# Altium project #NIP涡轮驱动板V1.00.PrjPcb
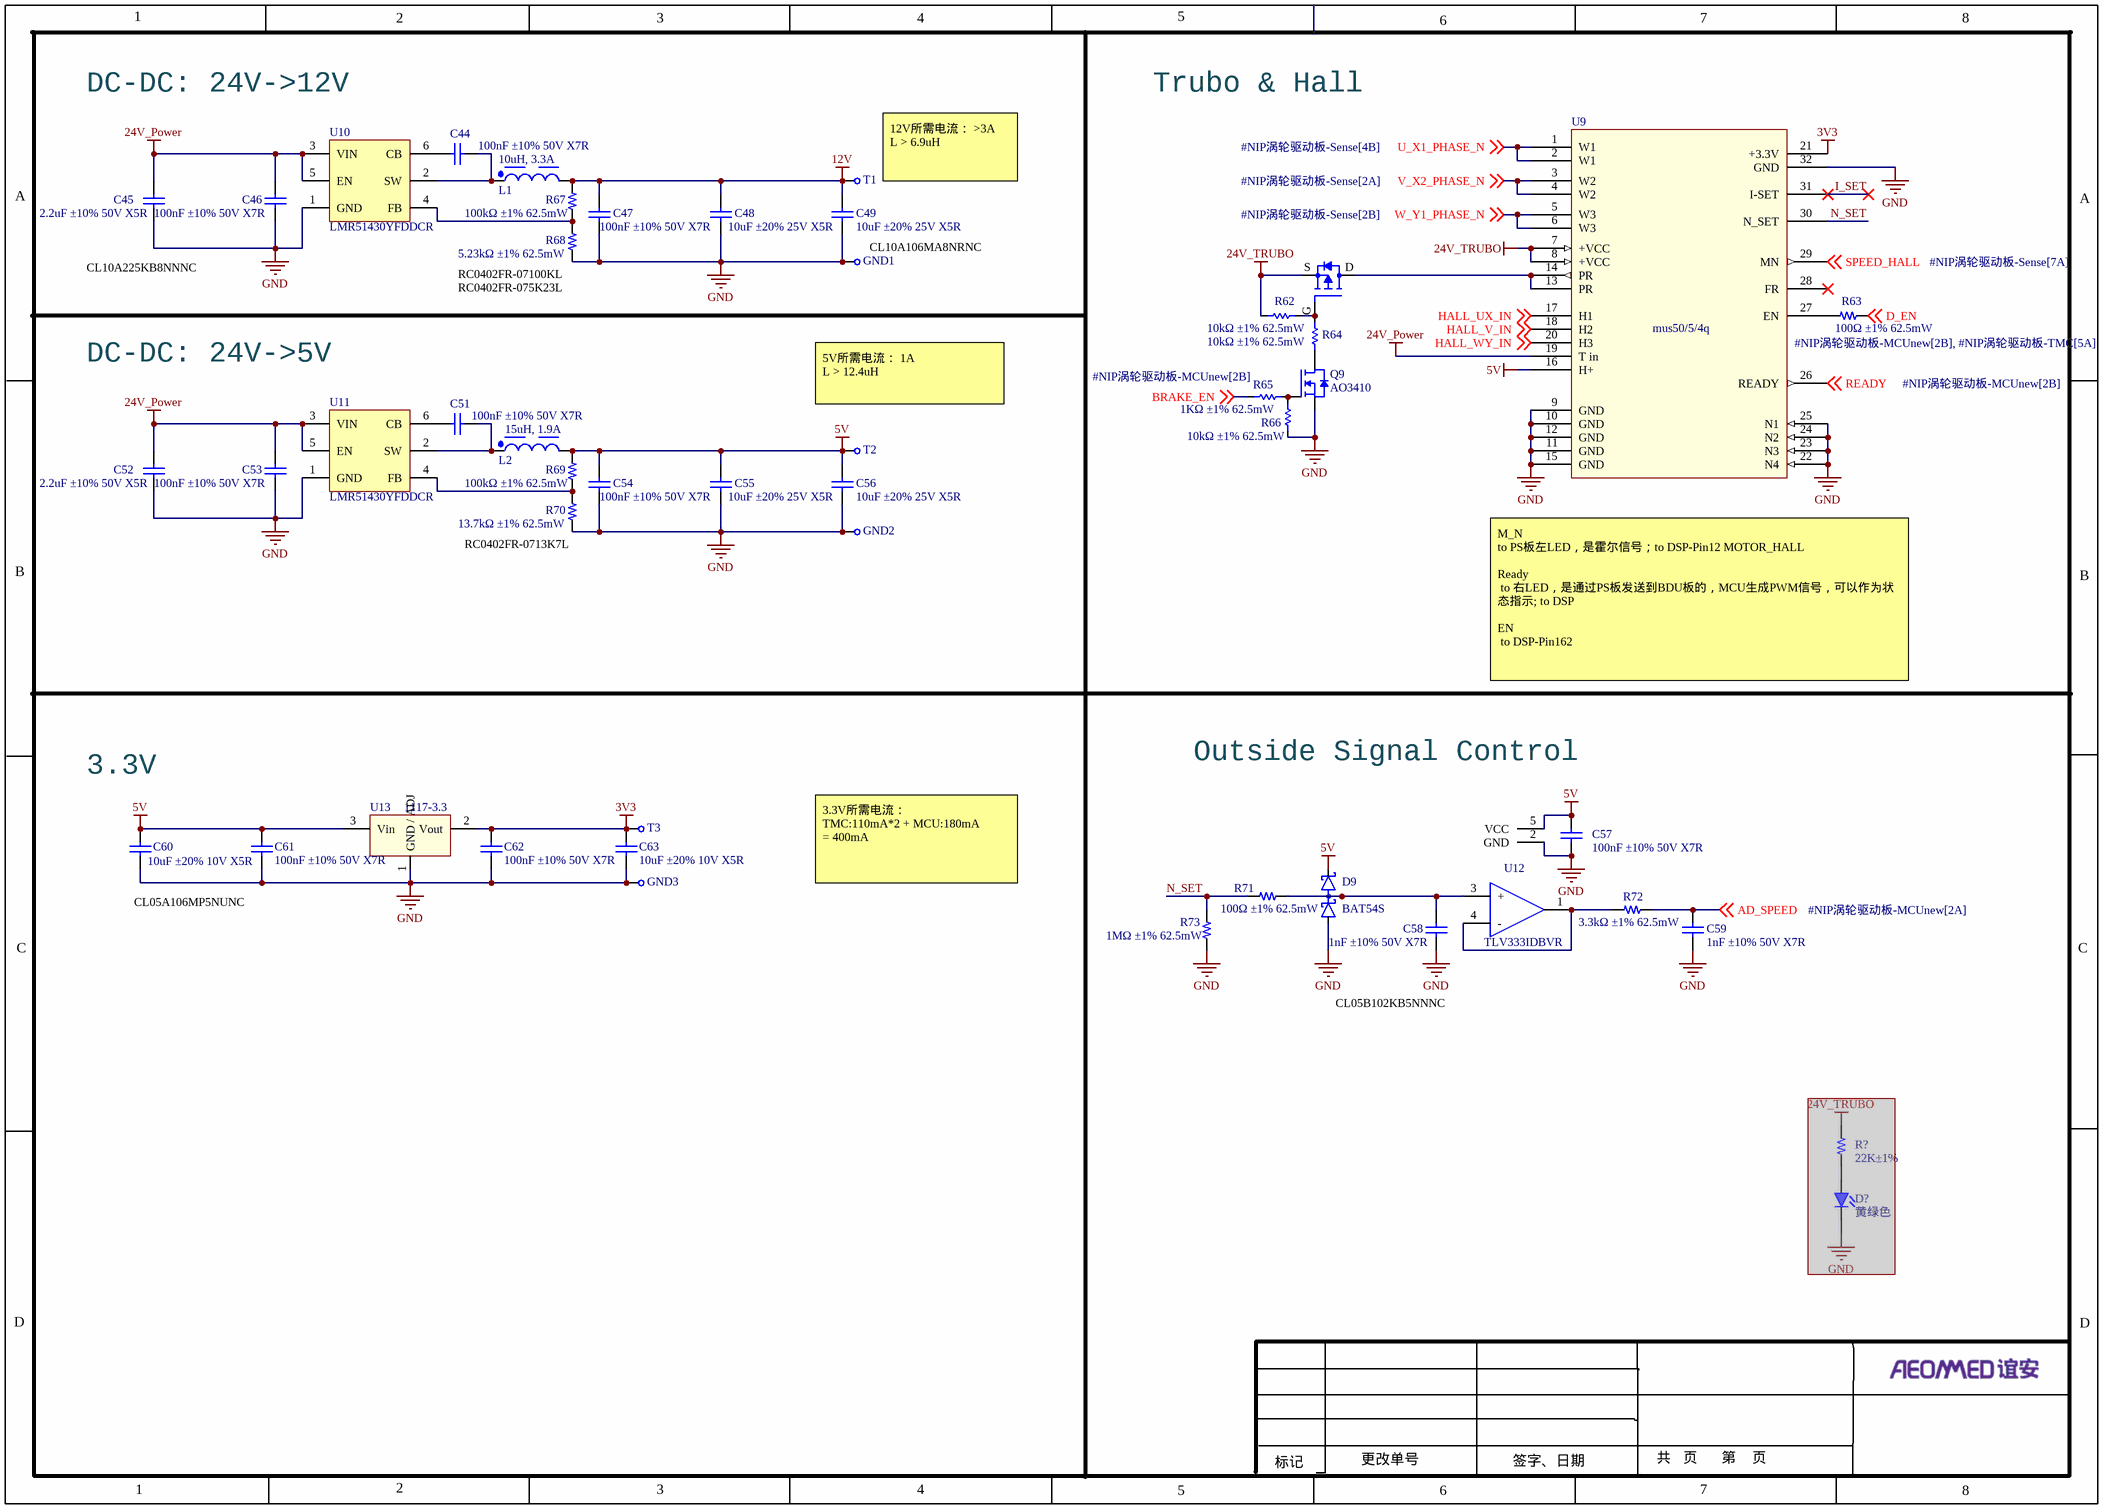
[diagram p0: #NIP涡轮驱动板-Power.SchDoc]
5 sheets, 200 parts. Net scope: global (net labels, ports and power ports of the same name join across sheets).
Board file: Turbo.PcbDoc
Sheets:
  #NIP涡轮驱动板-Power.SchDoc
  #NIP涡轮驱动板-TMC.SchDoc
  #NIP涡轮驱动板-MCUnew.SchDoc
  #NIP涡轮驱动板-DRIVE.SchDoc
  #NIP涡轮驱动板-Sense.SchDoc

## Sheet #NIP涡轮驱动板-Power.SchDoc
size A3; SPICEModelCacheKVCDXOIC: <root> / <DocumentId>KVCDXOIC</DocumentId> / <CacheFrame Number="0"> / <Model Name="4020_74438356150_15u" Kind="CKT"> / <Text>******* / .subckt 4020_74438356150_15u 1 2 / Rp 1 2 14200 / Cp 1 2 9.62p / Rs 1 N3 0.2 / L1 N3 2 14.1u / .ends 4020_74438356150_15u</Text> / </Model> / <Model Name="5030_74438367100_10u" Kind="CKT"> / <Text>******* / .subckt 5030_74438367100_10u 1 2 / Rp 1 2 7290 / Cp 1 2 15.66p / Rs 1 N3 0.061 / L1 N3 2 9.563u / .ends 5030_74438367100_10u</Text> / </Model> / </CacheFrame> / </root>

### Parts
(Parts that share a designator on the sheet are numbered #1, #2 ... from top to bottom, then left to right.)
C44  100nF ±10% 50V X7R  [C0402]
C45  2.2uF ±10% 50V X5R  [C0603]
C46  100nF ±10% 50V X7R  [C0402]
C47  100nF ±10% 50V X7R  [C0402]
C48  10uF ±20% 25V X5R  [C0603]
C49  10uF ±20% 25V X5R  [C0603]
C51  100nF ±10% 50V X7R  [C0402]
C52  2.2uF ±10% 50V X5R  [C0603]
C53  100nF ±10% 50V X7R  [C0402]
C54  100nF ±10% 50V X7R  [C0402]
C55  10uF ±20% 25V X5R  [C0603]
C56  10uF ±20% 25V X5R  [C0603]
C57  100nF ±10% 50V X7R  [C0402]
C58  1nF ±10% 50V X7R  [C0402]
C59  1nF ±10% 50V X7R  [C0402]
C60  10uF ±20% 10V X5R  [C0402]
C61  100nF ±10% 50V X7R  [C0402]
C62  100nF ±10% 50V X7R  [C0402]
C63  10uF ±20% 10V X5R  [C0402]
D9  BAT54S  [SOT23-3]
D?  黄绿色  [LED-0805]  (masked out: inside a compile mask, not in the netlist)
GND1  test_point  [TP-SIP-1-GND]  (value not drawn)
GND2  test_point  [TP-SIP-1-GND]  (value not drawn)
GND3  test_point  [TP-SIP-1-GND]  (value not drawn)
L1  10uH, 3.3A  [WE-MAPI_5030]
L2  15uH, 1.9A  [WE-MAPI_4020]
Q8  SI7463ADP-T1-GE3  [POWERPAK-SO-8_L6.1-W5.1-P1.27-BL-EP]  (value not drawn)
Q9  AO3410  [SOT23-3]
R62  10kΩ ±1% 62.5mW  [R0402]
R63  100Ω ±1% 62.5mW  [R0402]
R64  10kΩ ±1% 62.5mW  [R0402]
R65  1KΩ ±1% 62.5mW  [R0402]
R66  10kΩ ±1% 62.5mW  [R0402]
R67  100kΩ ±1% 62.5mW  [R0402]
R68  5.23kΩ ±1% 62.5mW  [R0402]
R69  100kΩ ±1% 62.5mW  [R0402]
R70  13.7kΩ ±1% 62.5mW  [R0402]
R71  100Ω ±1% 62.5mW  [R0402]
R72  3.3kΩ ±1% 62.5mW  [R0402]
R73#1  1MΩ ±1% 62.5mW  [R0402]
R?  22K±1%  [R-0603]  (masked out: inside a compile mask, not in the netlist)
T1  test_point  [TP-SIP-1-Small]  (value not drawn)
T2  test_point  [TP-SIP-1-Small]  (value not drawn)
T3  test_point  [TP-SIP-1-Small]  (value not drawn)
U9  mus50/5/4q  [MUS50/5/4Q]
U10  LMR51430YFDDCR  [SOT-23-6_L2.9-W1.6-P0.95-LS2.9-BL]
U11  LMR51430YFDDCR  [SOT-23-6_L2.9-W1.6-P0.95-LS2.9-BL]
U12  TLV333IDBVR  [SOT23-5]
U13  1117-3.3  [SOT-89-3_L4.5-W2.5-P1.50-LS4.0-BR]

### Nets
3V3: C62.2 C63.2 T3.1 U9.21(+3.3V) U13.2(Vout)
5V: C54.2 C55.2 C56.2 C57.2 C60.2 C61.2 D9.2(C2) L2.2 R69.2 T2.1 U9.16(H+) U12.5(VCC) U13.3(Vin)
12V: C47.2 C48.2 C49.2 L1.2 R67.2 T1.1
24V_Power: C45.2 C46.2 C52.2 C53.2 U9.19(T_in) U10.3(VIN) U10.5(EN) U11.3(VIN) U11.5(EN)
24V_TRUBO: Q8.S R62.2 U9.7(+VCC) U9.8(+VCC)
GND: C45.1 C46.1 C47.1 C48.1 C49.1 C52.1 C53.1 C54.1 C55.1 C56.1 C57.1 C58.1 C59.1 C60.1 C61.1 C62.1 C63.1 D9.1(A1) GND1.1 GND2.1 GND3.1 Q9.2(S) R66.2 R68.2 R70.2 R73#1.1 U9.9(GND) U9.10(GND) U9.11(GND) U9.12(GND) U9.15(GND) U9.22(N4) U9.23(N3) U9.24(N2) U9.25(N1) U9.32(GND) U10.1(GND) U11.1(GND) U12.2(GND) U13.1(GND_/_ADJ)
AD_SPEED: C59.2 R72.1 ; off-sheet AD_SPEED
BRAKE_EN: R65.1 ; off-sheet BRAKE_EN
D_EN: R63.1 ; off-sheet D_EN
HALL_UX_IN: U9.17(H1) ; off-sheet HALL_UX_IN
HALL_V_IN: U9.18(H2) ; off-sheet HALL_V_IN
HALL_WY_IN: U9.20(H3) ; off-sheet HALL_WY_IN
I_SET: U9.31(I-SET)
N_SET: R71.1 R73#1.2 U9.30(N_SET)
READY: U9.26(READY) ; off-sheet READY
SPEED_HALL: U9.29(MN) ; off-sheet SPEED_HALL
U_X1_PHASE_N: U9.1(W1) U9.2(W1) ; off-sheet U_X1_PHASE_N
V_X2_PHASE_N: U9.3(W2) U9.4(W2) ; off-sheet V_X2_PHASE_N
W_Y1_PHASE_N: U9.5(W3) U9.6(W3) ; off-sheet W_Y1_PHASE_N
NetC44_1: C44.1 L1.1 U10.2(SW)
NetC44_2: C44.2 U10.6(CB)
NetC51_1: C51.1 L2.1 U11.2(SW)
NetC51_2: C51.2 U11.6(CB)
NetC58_2: C58.2 D9.3(C1A2) R71.2 U12.3(+)
NetQ8_D: Q8.D U9.13(PR) U9.14(PR)
NetQ8_G: Q8.G R62.1 R64.1
NetQ9_1: Q9.1(G) R65.2 R66.1
NetQ9_3: Q9.3(D) R64.2
NetR63_2: R63.2 U9.27(EN)
NetR67_1: R67.1 R68.1 U10.4(FB)
NetR69_1: R69.1 R70.1 U11.4(FB)
NetR72_2: R72.2 U12.1 U12.4(-)

Not connected (* = marked no-connect by the designer): U9 28(FR)*

### Notes on the sheet
- DC-DC: 24V->12V
- Trubo & Hall
- (near T1) 12V所需电流： >3A
  L > 6.9uH
- (near C45) CL10A225KB8NNNC
- (near R68) RC0402FR-07100KL
- (near R68) RC0402FR-075K23L
- (near GND1) CL10A106MA8NRNC
- DC-DC: 24V->5V
- 5V所需电流： 1A
  L > 12.4uH
- (near R70) RC0402FR-0713K7L
- M_N
  to PS板左LED，是霍尔信号；to DSP-Pin12 MOTOR_HALL
  Ready
  to 右LED，是通过PS板发送到BDU板的，MCU生成PWM信号，可以作为状态指示; to DSP
  EN
  to DSP-Pin162
- 3.3V
- Outside Signal Control
- CL05A106MP5NUNC
- 3.3V所需电流：
  TMC:110mA*2 + MCU:180mA
  = 400mA
- CL05B102KB5NNNC
- 1
- 2
- 3
- 4
- 5
- 6
- 7
- 8
- A
- B
- C
- D
- 更改单号
- 共   页      第    页
- 标记
- 签字、日期

### Library data of the parts
C44 C46 C47 C51 C53 C54 C57 C61 C62 = Cap: Capacitor; Published: 8-Jun-2000; LatestRevisionDate: 17-Jul-2002; LatestRevisionNote: Re-released for DXP Platform.; PackageReference: RAD-0.3; Publisher: Altium Limited; PackageDescription: Radial Cap, Thru-Hole; 2 Leads; 0.3 in Pin Spacing
C45 C52 = Cap: CL10A225KB8NNNC; Published: 8-Jun-2000; LatestRevisionDate: 17-Jul-2002; LatestRevisionNote: Re-released for DXP Platform.; PackageReference: RAD-0.3; Publisher: Altium Limited; PackageDescription: Radial Cap, Thru-Hole; 2 Leads; 0.3 in Pin Spacing
C48 C49 C55 C56 = Cap: CL10A106MA8NRNC; Published: 8-Jun-2000; LatestRevisionDate: 17-Jul-2002; LatestRevisionNote: Re-released for DXP Platform.; PackageReference: RAD-0.3; Publisher: Altium Limited; PackageDescription: Radial Cap, Thru-Hole; 2 Leads; 0.3 in Pin Spacing
C58 C59 = Cap: CL05B102KB5NNNC; Published: 8-Jun-2000; LatestRevisionDate: 17-Jul-2002; LatestRevisionNote: Re-released for DXP Platform.; PackageReference: RAD-0.3; Publisher: Altium Limited; PackageDescription: Radial Cap, Thru-Hole; 2 Leads; 0.3 in Pin Spacing
C60 C63 = Cap: CL05A106MP5NUNC; Published: 8-Jun-2000; LatestRevisionDate: 17-Jul-2002; LatestRevisionNote: Re-released for DXP Platform.; PackageReference: RAD-0.3; Publisher: Altium Limited; PackageDescription: Radial Cap, Thru-Hole; 2 Leads; 0.3 in Pin Spacing
D9 = BAT54S: 品牌：NXP，型号：BAT54S，0.11A,30V，ROHS; MF: NXP; MPN: BAT54S
D? = LED-0805: 品牌:Everlight（亿光），型号17-21SYGC/S530-E2/TR8，Typ.23mcd@20mA，ROHS
GND1-GND3 T1-T3 = TP-SIP-1-Small
L1 = 74438367100: WE-MAPI, size 5030, 10uH, 3.3A, 70.2mOhm; Manufacturer: Wurth Elektronik; Case/Size Code: 5030; DC Resistance: 61mOhm; Saturation Current: 4.8A; Self Resonant Frequency: 13MHz; Manufacturer Part Number: 74438367100; Match Code: WE-MAPI; ComponentLink1Description: Website Link; ComponentLink1URL: https://www.we-online.com/redexpert/article/74438367100?ad; ComponentLink2Description: Datasheet Link; ComponentLink2URL: https://www.we-online.com/redexpert/spec/74438367100?ad; Mount: Surface Mount; Operating Temperature Max: 125°C; Operating Temperature Min: -40°C; Packaging: Tape and Reel; Length: 5.4mm; Width: 5.4mm; Height: 3.1mm; DC Resistance Max: 70.2mOhm; Inductance: 10uH; Rated Current: 3.3A
L2 = 74438356150: WE-MAPI, size 4020, 15uH, 1.9A, 230mOhm; Manufacturer: Wurth Elektronik; Case/Size Code: 4020; DC Resistance: 200mOhm; Saturation Current: 2.1A; Self Resonant Frequency: 14MHz; Manufacturer Part Number: 74438356150; Match Code: WE-MAPI; ComponentLink1Description: Website Link; ComponentLink1URL: https://www.we-online.com/redexpert/article/74438356150?ad; ComponentLink2Description: Datasheet Link; ComponentLink2URL: https://www.we-online.com/redexpert/spec/74438356150?ad; Mount: Surface Mount; Operating Temperature Max: 125°C; Operating Temperature Min: -40°C; Packaging: Tape and Reel; Length: 4.1mm; Width: 4.1mm; Height: 2.1mm; DC Resistance Max: 230mOhm; Inductance: 15uH; Rated Current: 1.9A
Q8 = MOSFET-P: 类型 P沟道 / 漏源电压(Vdss) 40V / 连续漏极电流(Id) 46A / 功率(Pd) 5W；39W / 导通电阻(RDS(on)@Vgs,Id) 10mΩ@15A,10V / 阈值电压(Vgs(th)@Id) 2.3V@250uA; Manufacturer: VISHAY(威世); Add into BOM: yes; Total Gate Charge (Qg@Vgs): 144nC@10V; Input Capacitance (Ciss@Vds): 4.15nF@20V; Symbol: SI7463ADP-T1-GE3; Device: SI7463ADP-T1-GE3; Supplier: LCSC; Supplier Part: C469466; Manufacturer Part: SI7463ADP-T1-GE3; JLCPCB Part Class: Extended Part; LCSC Part Name: P沟道 耐压:40V 电流:46A; Supplier Footprint: PowerPAK-SO-8; Datasheet: https://atta.szlcsc.com/upload/public/pdf/source/20201103/C469466_DEB614A703506C939C03FF0A9B0AE822.pdf; Convert to PCB: yes; Type: P沟道; Drain Source Voltage (Vdss): 40V; Continuous Drain Current (Id): 46A; Power Dissipation (Pd): 5W；39W; Drain Source On Resistance (RDS(on)@Vgs,Id): 10mΩ@15A,10V; Gate Threshold Voltage (Vgs(th)@Id): 2.3V@250uA; Reverse Transfer Capacitance (Crss@Vds): -; Operating Temperature: -55℃~+150℃@(Tj)
R62 R64-R66 = Res_0402: Resistor; Published: 8-Jun-2000; LatestRevisionDate: 17-Jul-2002; LatestRevisionNote: Re-released for DXP Platform.; PackageReference: AXIAL-0.3; Publisher: Altium Limited; PackageDescription: Axial Device, Thru-Hole; 2 Leads; 0.3 in Pin Spacing
R63 R71 R72 R73#1 R? = R-0603
R67 R69 = R-0603: RC0402FR-07100KL
R68 = R-0603: RC0402FR-075K23L
R70 = R-0603: RC0402FR-0713K7L
U9 = mus50/5/4q: 品牌：长江（CJT） / A: A2005WVA-12P / B: A2541WV-2x10P
U10 U11 = LMR51430Y: 输入电压 4.5V~36V / 输出电压 600mV~34.2V / 输出电流(最大值) 3A / 开关频率 1.1MHz / 工作温度 -40℃~+150℃ / 静态电流(Iq) 40uA
U12 = TLV333IDBVR: 品牌：TI，型号：TLV333IDBVR,SOIC-8,–25°~+85°C,单运放，ROHS
U13 = 1117_SOT89: SOT-89-3

## Sheet #NIP涡轮驱动板-TMC.SchDoc
size A3
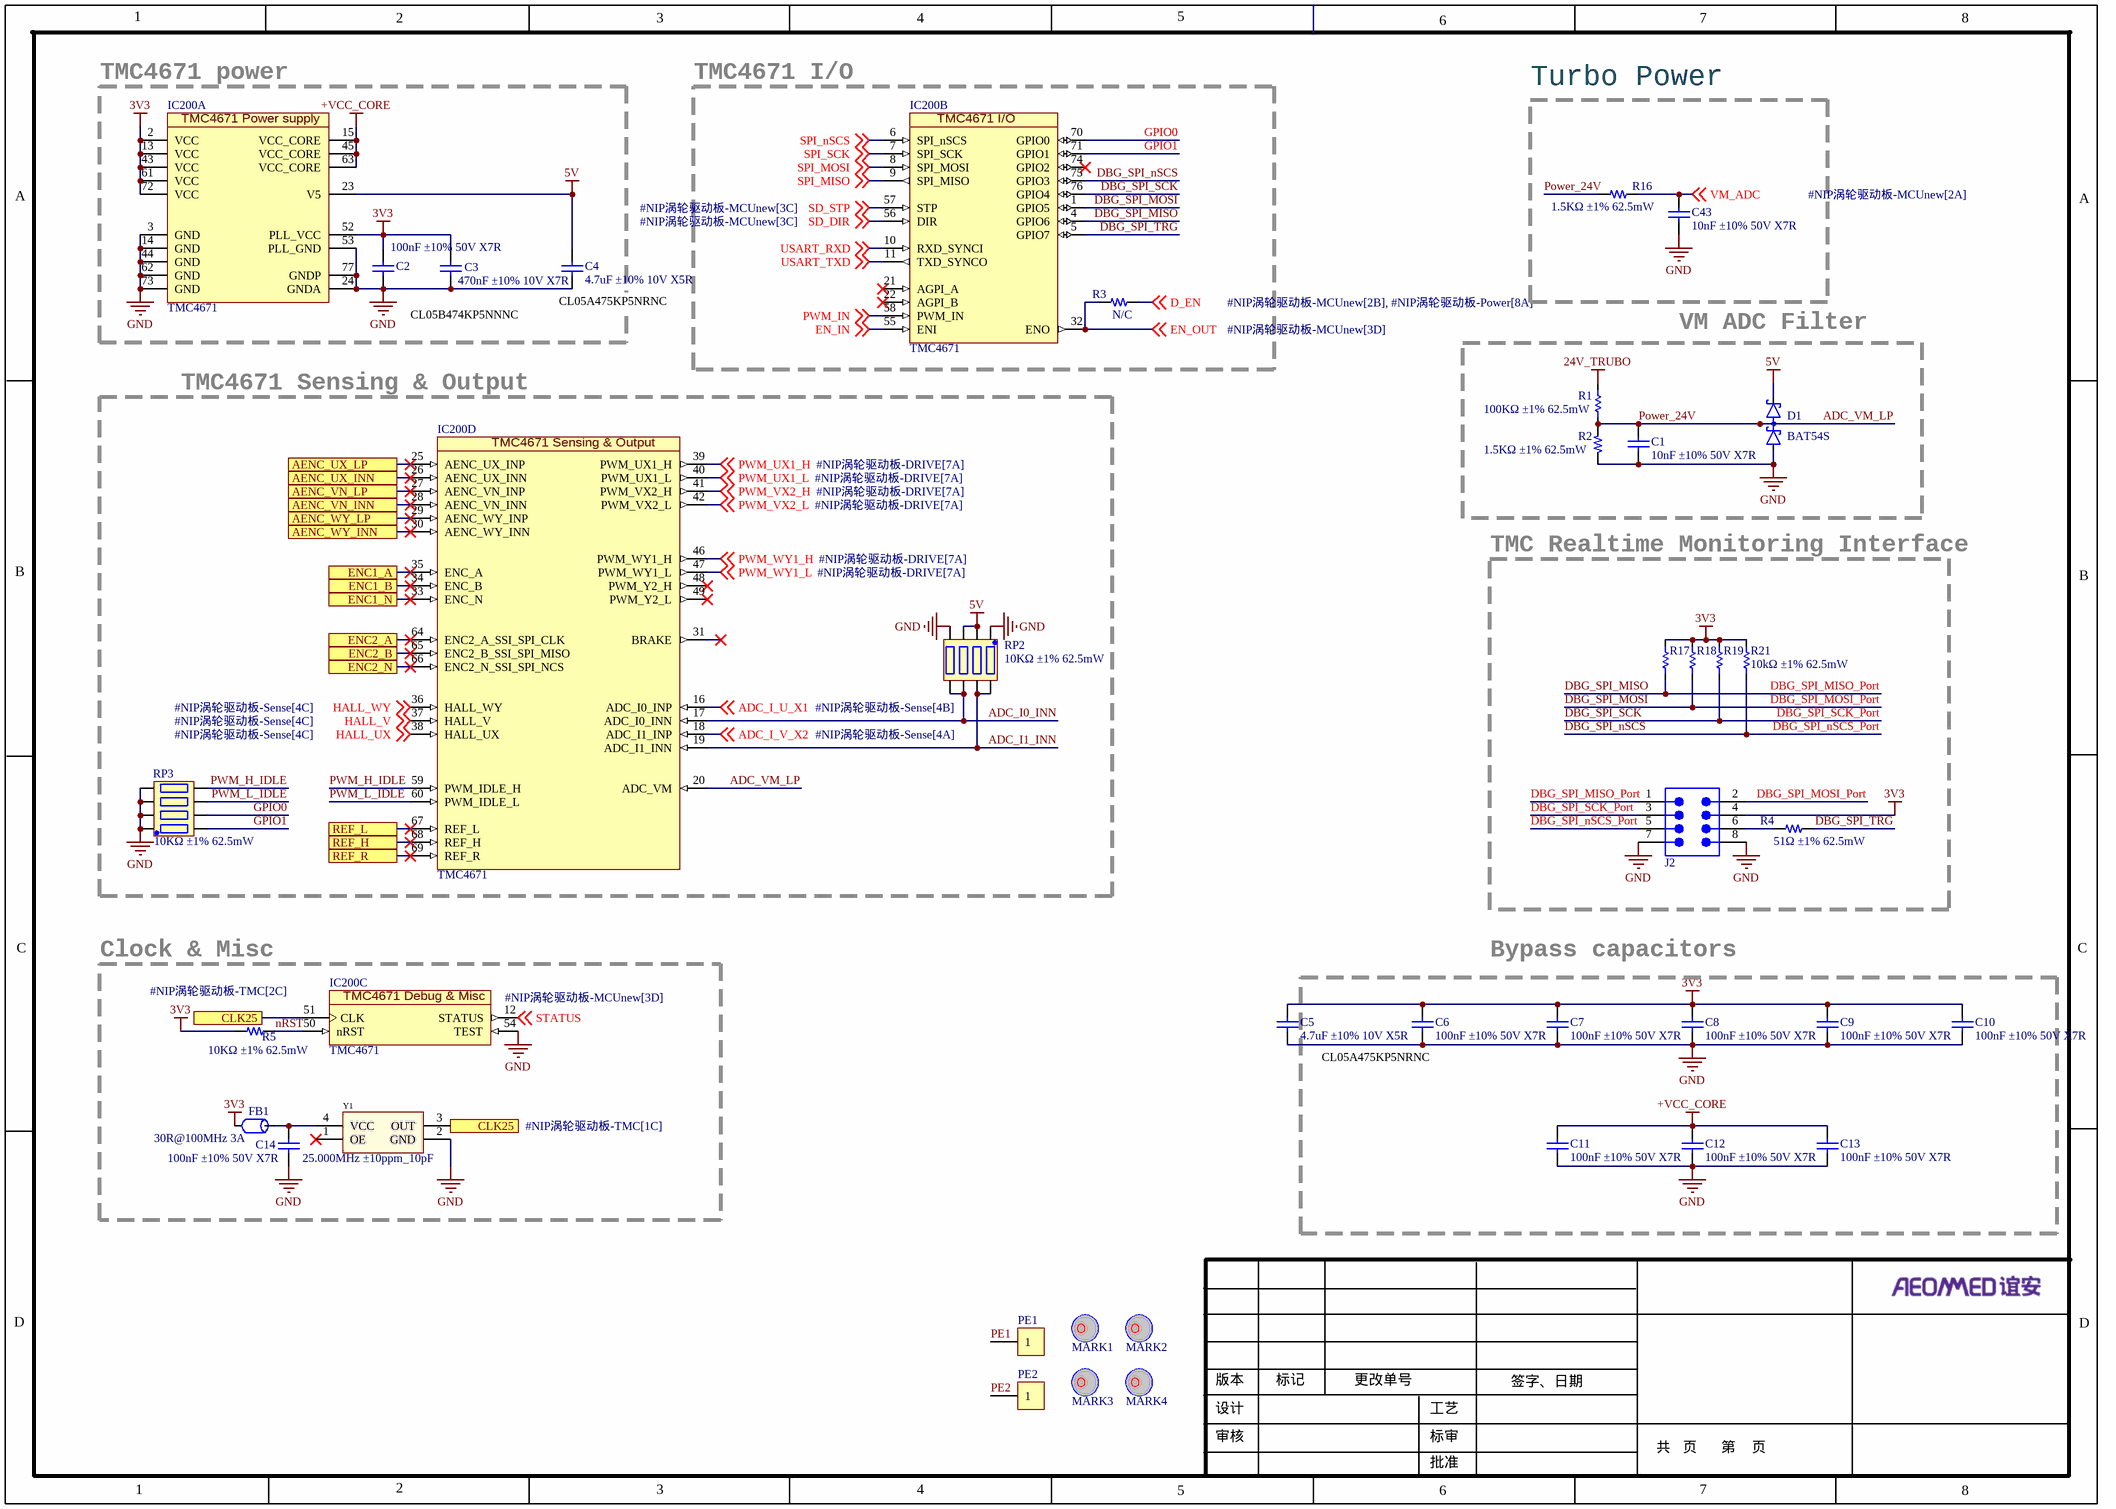
[diagram p1: #NIP涡轮驱动板-TMC.SchDoc]

### Parts
C1  10nF ±10% 50V X7R  [C0402]
C2  100nF ±10% 50V X7R  [C0402]
C3  470nF ±10% 10V X7R  [C0402]
C4  4.7uF ±10% 10V X5R  [C0402]
C5  4.7uF ±10% 10V X5R  [C0402]
C6  100nF ±10% 50V X7R  [C0402]
C7  100nF ±10% 50V X7R  [C0402]
C8  100nF ±10% 50V X7R  [C0402]
C9  100nF ±10% 50V X7R  [C0402]
C10  100nF ±10% 50V X7R  [C0402]
C11  100nF ±10% 50V X7R  [C0402]
C12  100nF ±10% 50V X7R  [C0402]
C13  100nF ±10% 50V X7R  [C0402]
C14  100nF ±10% 50V X7R  [C0402]
C43  10nF ±10% 50V X7R  [C0402]
D1  BAT54S  [SOT23-3]
FB1  30R@100MHz 3A  [FB-0603]
IC200  TMC4671  [QFN40P1050X650X90_HS-77N]  (parts A,B,C,D of 5)
J2  62000821121  [62000821121]  (value not drawn)
MARK1  MARK_POINT  [MARK_POINT]  (value not drawn)
MARK2  MARK_POINT  [MARK_POINT]  (value not drawn)
MARK3  MARK_POINT  [MARK_POINT]  (value not drawn)
MARK4  MARK_POINT  [MARK_POINT]  (value not drawn)
PE1  (no value)  [固定孔-M3]
PE2  (no value)  [固定孔-M3]
R1  100KΩ ±1% 62.5mW  [R0402]
R2  1.5KΩ ±1% 62.5mW  [R0402]
R3  N/C  [R0402]
R4  51Ω ±1% 62.5mW  [R0402]
R5  10KΩ ±1% 62.5mW  [R0402]
R16  1.5KΩ ±1% 62.5mW  [R0402]
R17  10kΩ ±1% 62.5mW  [R0402]  (value not drawn)
R18  10kΩ ±1% 62.5mW  [R0402]  (value not drawn)
R19  10kΩ ±1% 62.5mW  [R0402]  (value not drawn)
R21  10kΩ ±1% 62.5mW  [R0402]
RP2  10KΩ ±1% 62.5mW  [RES-ARRAY-SMD_0402-8P-L2.0-W1.0-BL]
RP3  10KΩ ±1% 62.5mW  [RES-ARRAY-SMD_0402-8P-L2.0-W1.0-BL]
Y1  25.000MHz ±10ppm_10pF  [OSC-SMD_4P-L2.5-W2.0-BL-1]

### Blocks framed on the sheet
TMC4671 power: C2-C4 IC200
TMC4671 I/O: IC200 R3
Turbo Power: C43 R16
VM ADC Filter: C1 D1 R1 R2
TMC4671 Sensing & Output: IC200 RP2 RP3
TMC Realtime Monitoring Interface: J2 R4 R17-R19 R21
Clock & Misc: C14 FB1 IC200 R5 Y1
Bypass capacitors: C6-C13

### Ports
AENC_UX_INN, AENC_UX_LP, AENC_VN_INN, AENC_VN_LP, AENC_WY_INN, AENC_WY_LP, CLK25 (see #NIP涡轮驱动板-TMC[1C]), CLK25 (see #NIP涡轮驱动板-TMC[2C]), ENC1_A, ENC1_B, ENC1_N, ENC2_A, ENC2_B, ENC2_N, REF_H, REF_L, REF_R

### Nets
3V3: C2.2 C3.2 C5.2 C6.2 C7.2 C8.2 C9.2 C10.2 FB1.2 IC200.2(VCC) IC200.13(VCC) IC200.43(VCC) IC200.52(PLL_VCC) IC200.61(VCC) IC200.72(VCC) J2.4 R5.1 R17.2 R18.2 R19.2 R21.2
5V: C4.2 D1.2(C2) IC200.23(V5) RP2.2 RP2.3
24V_TRUBO: R1.2
+VCC_CORE: C11.2 C12.2 C13.2 IC200.15(VCC_CORE) IC200.45(VCC_CORE) IC200.63(VCC_CORE)
GND: C1.1 C2.1 C3.1 C4.1 C5.1 C6.1 C7.1 C8.1 C9.1 C10.1 C11.1 C12.1 C13.1 C14.1 C43.1 D1.1(A1) IC200.3(GND) IC200.14(GND) IC200.24(GNDA) IC200.44(GND) IC200.53(PLL_GND) IC200.54(TEST) IC200.62(GND) IC200.73(GND) IC200.77(GNDP) J2.7 J2.8 R2.1 RP2.1 RP2.4 RP3.1 RP3.2 RP3.3 RP3.4 Y1.2(GND)
ADC_I0_INN: IC200.17(ADC_I0_INN) RP2.5 RP2.6
ADC_I1_INN: IC200.19(ADC_I1_INN) RP2.7 RP2.8
ADC_I_U_X1: IC200.16(ADC_I0_INP) ; off-sheet ADC_I_U_X1
ADC_I_V_X2: IC200.18(ADC_I1_INP) ; off-sheet ADC_I_V_X2
ADC_VM_LP: C1.2 D1.3(C1A2) IC200.20(ADC_VM) R1.1 R2.2 R16.1  [also labelled Power_24V]
D_EN: R3.2 ; off-sheet D_EN
DBG_SPI_MISO: IC200.4(GPIO6) J2.1 R17.1  [also labelled DBG_SPI_MISO_Port]
DBG_SPI_MOSI: IC200.1(GPIO5) J2.2 R18.1  [also labelled DBG_SPI_MOSI_Port]
DBG_SPI_nSCS: IC200.75(GPIO3) J2.5 R21.1  [also labelled DBG_SPI_nSCS_Port]
DBG_SPI_SCK: IC200.76(GPIO4) J2.3 R19.1  [also labelled DBG_SPI_SCK_Port]
DBG_SPI_TRG: IC200.5(GPIO7) R4.2
EN_IN: IC200.55(ENI) ; off-sheet EN_IN
EN_OUT: IC200.32(ENO) R3.1 ; off-sheet EN_OUT
GPIO0: IC200.70(GPIO0) RP3.7
GPIO1: IC200.71(GPIO1) RP3.8
HALL_UX: IC200.38(HALL_UX) ; off-sheet HALL_UX
HALL_V: IC200.37(HALL_V) ; off-sheet HALL_V
HALL_WY: IC200.36(HALL_WY) ; off-sheet HALL_WY
nRST: IC200.50(nRST) R5.2
PE1: PE1.1
PE2: PE2.1
PWM_H_IDLE: IC200.59(PWM_IDLE_H) RP3.5
PWM_IN: IC200.58(PWM_IN) ; off-sheet PWM_IN
PWM_L_IDLE: IC200.60(PWM_IDLE_L) RP3.6
PWM_UX1_H: IC200.39(PWM_UX1_H) ; off-sheet PWM_UX1_H
PWM_UX1_L: IC200.40(PWM_UX1_L) ; off-sheet PWM_UX1_L
PWM_VX2_H: IC200.41(PWM_VX2_H) ; off-sheet PWM_VX2_H
PWM_VX2_L: IC200.42(PWM_VX2_L) ; off-sheet PWM_VX2_L
PWM_WY1_H: IC200.46(PWM_WY1_H) ; off-sheet PWM_WY1_H
PWM_WY1_L: IC200.47(PWM_WY1_L) ; off-sheet PWM_WY1_L
SD_DIR: IC200.56(DIR) ; off-sheet SD_DIR
SD_STP: IC200.57(STP) ; off-sheet SD_STP
SPI_MISO: IC200.9(SPI_MISO) ; off-sheet SPI_MISO
SPI_MOSI: IC200.8(SPI_MOSI) ; off-sheet SPI_MOSI
SPI_nSCS: IC200.6(SPI_nSCS) ; off-sheet SPI_nSCS
SPI_SCK: IC200.7(SPI_SCK) ; off-sheet SPI_SCK
STATUS: IC200.12(STATUS) ; off-sheet STATUS
USART_RXD: IC200.10(RXD_SYNCI) ; off-sheet USART_RXD
USART_TXD: IC200.11(TXD_SYNCO) ; off-sheet USART_TXD
VM_ADC: C43.2 R16.2 ; off-sheet VM_ADC
NetC14_2: C14.2 FB1.1 Y1.4(VCC)
NetIC200_25: IC200.25(AENC_UX_INP) ; port AENC_UX_LP
NetIC200_26: IC200.26(AENC_UX_INN) ; port AENC_UX_INN
NetIC200_27: IC200.27(AENC_VN_INP) ; port AENC_VN_LP
NetIC200_28: IC200.28(AENC_VN_INN) ; port AENC_VN_INN
NetIC200_29: IC200.29(AENC_WY_INP) ; port AENC_WY_LP
NetIC200_30: IC200.30(AENC_WY_INN) ; port AENC_WY_INN
NetIC200_33: IC200.33(ENC_N) ; port ENC1_N
NetIC200_34: IC200.34(ENC_B) ; port ENC1_B
NetIC200_35: IC200.35(ENC_A) ; port ENC1_A
NetIC200_51: IC200.51(CLK) Y1.3(OUT) ; port CLK25
NetIC200_64: IC200.64(ENC2_A_SSI_SPI_CLK) ; port ENC2_A
NetIC200_65: IC200.65(ENC2_B_SSI_SPI_MISO) ; port ENC2_B
NetIC200_66: IC200.66(ENC2_N_SSI_SPI_NCS) ; port ENC2_N
NetIC200_67: IC200.67(REF_L) ; port REF_L
NetIC200_68: IC200.68(REF_H) ; port REF_H
NetIC200_69: IC200.69(REF_R) ; port REF_R
NetJ2_6: J2.6 R4.1

Not connected (* = marked no-connect by the designer): IC200 21(AGPI_A)* 22(AGPI_B)* 31(BRAKE)* 48(PWM_Y2_H)* 49(PWM_Y2_L)* 74(GPIO2)*; Y1 1(OE)*

### Notes on the sheet
- CL05B474KP5NNNC
- (near C4) CL05A475KP5NRNC
- (near C6) CL05A475KP5NRNC
- 1
- 2
- 3
- 4
- 5
- 6
- 7
- 8
- A
- B
- C
- D
- 版本
- 标记
- 更改单号
- 签字、日期
- 设计
- 审核
- 工艺
- 标审
- 共   页      第    页
- 批准
- (in symbol TMC4671, part A) TMC4671 Power supply
- (in symbol TMC4671, part B) TMC4671 I/O
- (in symbol TMC4671, part C) TMC4671 Debug & Misc
- (in symbol TMC4671, part D) TMC4671 Sensing & Output

### Library data of the parts
C1 C43 = C-0603: CL05B103KB5NNNC; 物料编号: *; 物料名称: *; 厂家: *; 详细描述: *
C2 C6-C14 = Cap: Capacitor; Published: 8-Jun-2000; LatestRevisionDate: 17-Jul-2002; LatestRevisionNote: Re-released for DXP Platform.; PackageReference: RAD-0.3; Publisher: Altium Limited; PackageDescription: Radial Cap, Thru-Hole; 2 Leads; 0.3 in Pin Spacing
C3 = Cap: CL05B474KP5NNNC; Published: 8-Jun-2000; LatestRevisionDate: 17-Jul-2002; LatestRevisionNote: Re-released for DXP Platform.; PackageReference: RAD-0.3; Publisher: Altium Limited; PackageDescription: Radial Cap, Thru-Hole; 2 Leads; 0.3 in Pin Spacing
C4 C5 = Cap: CL05A475KP5NRNC; Published: 8-Jun-2000; LatestRevisionDate: 17-Jul-2002; LatestRevisionNote: Re-released for DXP Platform.; PackageReference: RAD-0.3; Publisher: Altium Limited; PackageDescription: Radial Cap, Thru-Hole; 2 Leads; 0.3 in Pin Spacing
D1 = BAT54S: 品牌：NXP，型号：BAT54S，0.11A,30V，ROHS; MF: NXP; MPN: BAT54S
FB1 = FB-0603: 品牌：TDK，型号：MPZ1608S601A , 600 ohm@100MHz ，1 A，25%，ROHS
IC200 = TMC4671: 品牌：TRINAMIC，型号：TMC4671，ROHS; MPN: TMC4671; MF: TRINAMIC
J2 = 62000821121: WR-PHD Pin Header, THT, Vertical, pitch 2mm, 2 Row, 8P; Manufacturer: Wurth Elektronik; Contact Resistance: 20mOhm; Rated Current: 2A; Working Voltage: 200V; Withstanding Voltage: 500V; Manufacturer Part Number: 62000821121; Category: Board-to-Board Connectors; Match Code: WR-PHD; ComponentLink1Description: Website Link; ComponentLink1URL: https://www.we-online.com/redexpert/article/62000821121?ad; ComponentLink2Description: Datasheet Link; ComponentLink2URL: https://www.we-online.com/redexpert/spec/62000821121?ad; Mount: Through Hole; Operating Temperature Max: 105°C; Operating Temperature Min: -40°C; Packaging: Bag; Gender: Pin Header; Number of Pins: 8; Number of Rows: 2; Orientation: Vertical; Pitch: 2mm
PE1 PE2 = CON1: Connector
R1 = Res_0402: RC0402FR-07100KL; Published: 8-Jun-2000; LatestRevisionDate: 17-Jul-2002; LatestRevisionNote: Re-released for DXP Platform.; PackageReference: AXIAL-0.3; Publisher: Altium Limited; PackageDescription: Axial Device, Thru-Hole; 2 Leads; 0.3 in Pin Spacing
R2-R5 R16 = R-0603
R17-R19 R21 = Res_0402: Resistor; Published: 8-Jun-2000; LatestRevisionDate: 17-Jul-2002; LatestRevisionNote: Re-released for DXP Platform.; PackageReference: AXIAL-0.3; Publisher: Altium Limited; PackageDescription: Axial Device, Thru-Hole; 2 Leads; 0.3 in Pin Spacing
RP2 RP3 = RP-0603
Y1 = oscillator: YSO110TR 25MHZ 1.8V-3.3V ±10PPM -40~85℃（±20PPM) CMOS OT3JI-111-25M; Manufacturer: EPSON(爱普生); Name: 100MHz; Symbol: SG-8101CE-100.000000MHZ-TCHPA; Device: SG-8101CE 100.000000MHz TCHPA; Add into BOM: yes; Value: 100MHz; Frequency Stability: ±20ppm; Supply Voltage: 1.8V~3.3V; LCSC Part Name: 3225 100MHz 1.8~3.3V 20ppm  OE  SMD_4P -40~+105℃; Supplier Part: C390559; Manufacturer Part: SG-8101CE 100.000000MHz TCHPA; Supplier Footprint: SMD3225-4P; JLCPCB Part Class: Extended Part; Datasheet: https://atta.szlcsc.com/upload/public/pdf/source/20190626/C390559_D0305530A2A3721045533DB4F9788766.pdf; Supplier: LCSC; Convert to PCB: yes; Operating Temperature: -40℃~+105℃

## Sheet #NIP涡轮驱动板-MCUnew.SchDoc
size A3
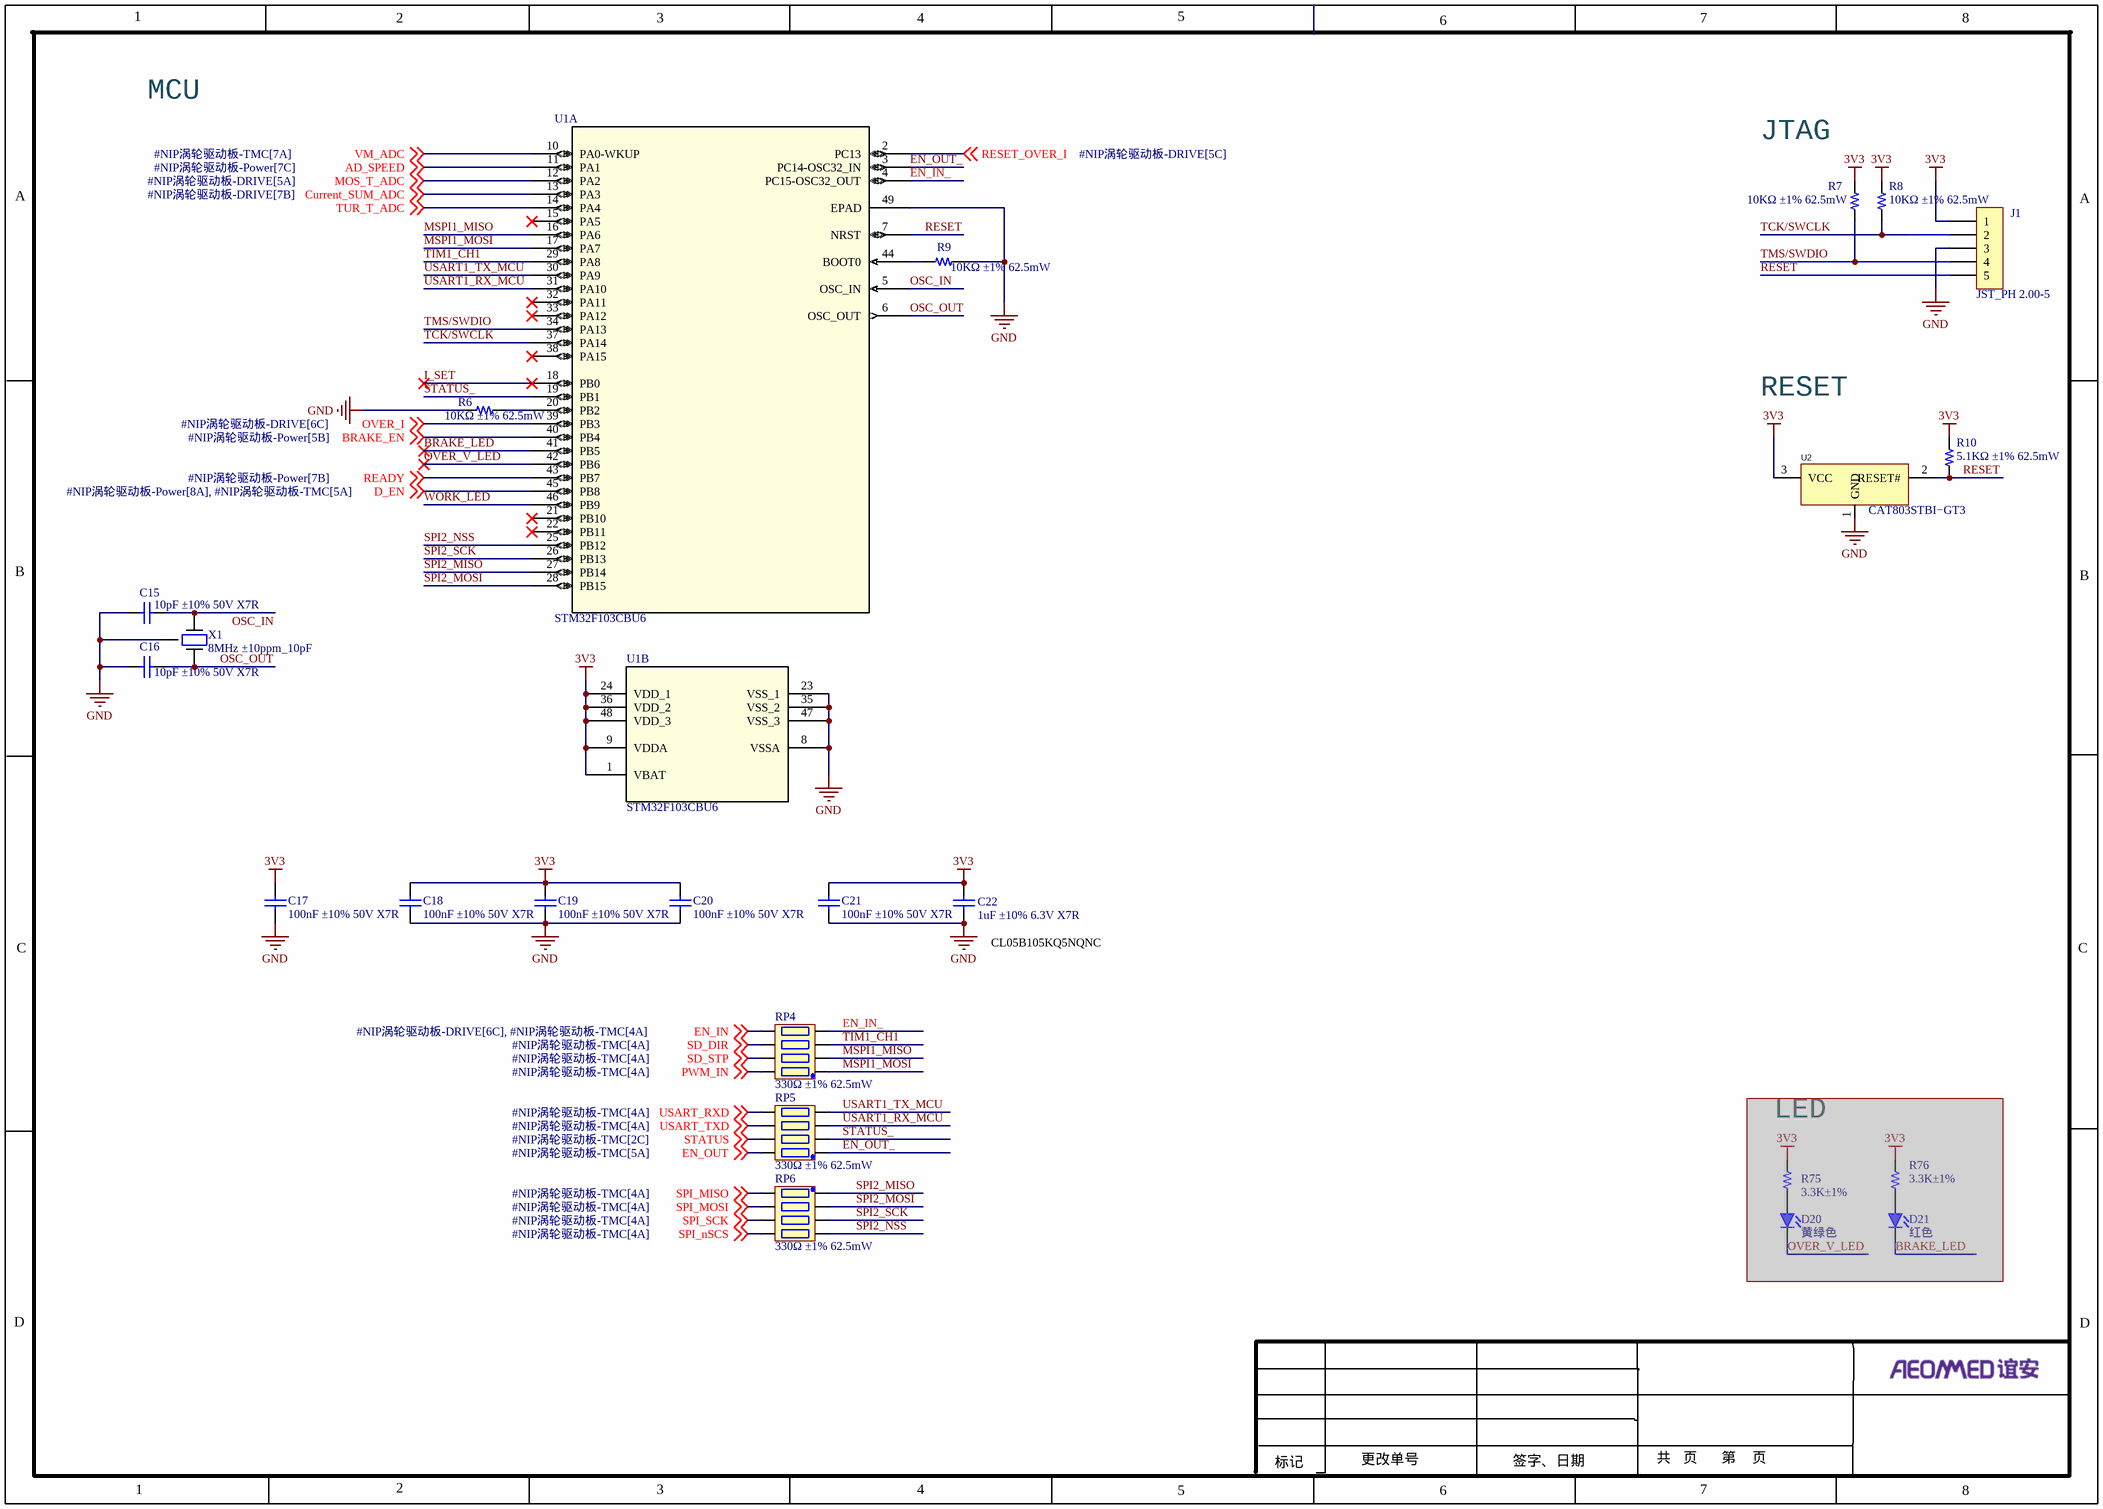
[diagram p2: #NIP涡轮驱动板-MCUnew.SchDoc]

### Parts
(Parts that share a designator on the sheet are numbered #1, #2 ... from top to bottom, then left to right.)
C15  10pF ±10% 50V X7R  [C0402]
C16  10pF ±10% 50V X7R  [C0402]
C17  100nF ±10% 50V X7R  [C0402]
C18  100nF ±10% 50V X7R  [C0402]
C19  100nF ±10% 50V X7R  [C0402]
C20  100nF ±10% 50V X7R  [C0402]
C21  100nF ±10% 50V X7R  [C0402]
C22  1uF ±10% 6.3V X7R  [C0402]
D20  黄绿色  [LED-0805]  (masked out: inside a compile mask, not in the netlist)
D21  红色  [LED-0805]  (masked out: inside a compile mask, not in the netlist)
J1#1  JST_PH 2.00-5  [JST_PH 2.00-5]
R6  10KΩ ±1% 62.5mW  [R0402]
R7  10KΩ ±1% 62.5mW  [R0402]
R8  10KΩ ±1% 62.5mW  [R0402]
R9#1  10KΩ ±1% 62.5mW  [R0402]
R10#1  5.1KΩ ±1% 62.5mW  [R0402]
R75  3.3K±1%  [R-0603]  (masked out: inside a compile mask, not in the netlist)
R76  3.3K±1%  [R-0603]  (masked out: inside a compile mask, not in the netlist)
RP4  330Ω ±1% 62.5mW  [RES-ARRAY-SMD_0402-8P-L2.0-W1.0-BL]
RP5  330Ω ±1% 62.5mW  [RES-ARRAY-SMD_0402-8P-L2.0-W1.0-BL]
RP6  330Ω ±1% 62.5mW  [RES-ARRAY-SMD_0402-8P-L2.0-W1.0-BL]
U1  STM32F103CBU6  [UFQFPN-48_7X7X0P55MM]  (parts A,B of 2)
U2  CAT803STBI−GT3  [SOT-23-3_L2.9-W1.3-P1.90-LS2.4-BR]
X1  8MHz ±10ppm_10pF  [CRYSTAL_3225]

### Nets
3V3: C17.1 C18.1 C19.2 C20.2 C21.1 C22.2 J1#1.1 R7.2 R8.2 R10#1.2 U1.1(VBAT) U1.9(VDDA) U1.24(VDD_1) U1.36(VDD_2) U1.48(VDD_3) U2.3(VCC)
GND: C15.2 C16.2 C17.2 C18.2 C19.1 C20.1 C21.2 C22.1 J1#1.3 R6.2 R9#1.2 U1.8(VSSA) U1.23(VSS_1) U1.35(VSS_2) U1.47(VSS_3) U1.49(EPAD) U2.1(GND) X1.G
AD_SPEED: U1.11(PA1) ; off-sheet AD_SPEED
BRAKE_EN: U1.40(PB4) ; off-sheet BRAKE_EN
BRAKE_LED: U1.41(PB5)
Current_SUM_ADC: U1.13(PA3) ; off-sheet Current_SUM_ADC
D_EN: U1.45(PB8) ; off-sheet D_EN
EN_IN: RP4.5 ; off-sheet EN_IN
EN_IN_: RP4.4 U1.4(PC15-OSC32_OUT)
EN_OUT: RP5.8 ; off-sheet EN_OUT
EN_OUT_: RP5.1 U1.3(PC14-OSC32_IN)
I_SET: U1.18(PB0)
MOS_T_ADC: U1.12(PA2) ; off-sheet MOS_T_ADC
MSPI1_MISO: RP4.2 U1.16(PA6)
MSPI1_MOSI: RP4.1 U1.17(PA7)
OSC_IN: C15.1 U1.5(OSC_IN) X1.1
OSC_OUT: C16.1 U1.6(OSC_OUT) X1.3
OVER_I: U1.39(PB3) ; off-sheet OVER_I
OVER_V_LED: U1.42(PB6)
PWM_IN: RP4.8 ; off-sheet PWM_IN
READY: U1.43(PB7) ; off-sheet READY
RESET: J1#1.5 R10#1.1 U1.7(NRST) U2.2(RESET#)
RESET_OVER_I: U1.2(PC13) ; off-sheet RESET_OVER_I
SD_DIR: RP4.6 ; off-sheet SD_DIR
SD_STP: RP4.7 ; off-sheet SD_STP
SPI2_MISO: RP6.1 U1.27(PB14)
SPI2_MOSI: RP6.2 U1.28(PB15)
SPI2_NSS: RP6.4 U1.25(PB12)
SPI2_SCK: RP6.3 U1.26(PB13)
SPI_MISO: RP6.8 ; off-sheet SPI_MISO
SPI_MOSI: RP6.7 ; off-sheet SPI_MOSI
SPI_nSCS: RP6.5 ; off-sheet SPI_nSCS
SPI_SCK: RP6.6 ; off-sheet SPI_SCK
STATUS: RP5.7 ; off-sheet STATUS
STATUS_: RP5.2 U1.19(PB1)
TCK/SWCLK: J1#1.2 R8.1 U1.37(PA14)
TIM1_CH1: RP4.3 U1.29(PA8)
TMS/SWDIO: J1#1.4 R7.1 U1.34(PA13)
TUR_T_ADC: U1.14(PA4) ; off-sheet TUR_T_ADC
USART1_RX_MCU: RP5.3 U1.31(PA10)
USART1_TX_MCU: RP5.4 U1.30(PA9)
USART_RXD: RP5.5 ; off-sheet USART_RXD
USART_TXD: RP5.6 ; off-sheet USART_TXD
VM_ADC: U1.10(PA0-WKUP) ; off-sheet VM_ADC
WORK_LED: U1.46(PB9)
NetR6_1: R6.1 U1.20(PB2)
NetR9#1_1: R9#1.1 U1.44(BOOT0)

Not connected (* = marked no-connect by the designer): U1 15(PA5)* 21(PB10)* 22(PB11)* 32(PA11)* 33(PA12)* 38(PA15)*

### Notes on the sheet
- MCU
- JTAG
- RESET
- (near C22) CL05B105KQ5NQNC
- (near R75) LED
- 1
- 2
- 3
- 4
- 5
- 6
- 7
- 8
- A
- B
- C
- D
- 更改单号
- 共   页      第    页
- 标记
- 签字、日期

### Library data of the parts
C15-C21 = Cap: Capacitor; Published: 8-Jun-2000; LatestRevisionDate: 17-Jul-2002; LatestRevisionNote: Re-released for DXP Platform.; PackageReference: RAD-0.3; Publisher: Altium Limited; PackageDescription: Radial Cap, Thru-Hole; 2 Leads; 0.3 in Pin Spacing
C22 = Cap: CL05B105KQ5NQNC; Published: 8-Jun-2000; LatestRevisionDate: 17-Jul-2002; LatestRevisionNote: Re-released for DXP Platform.; PackageReference: RAD-0.3; Publisher: Altium Limited; PackageDescription: Radial Cap, Thru-Hole; 2 Leads; 0.3 in Pin Spacing
D20 = LED-0805: as D? on sheet #NIP涡轮驱动板-Power
D21 = LED-0805: 品牌:Everlight（亿光），型号:17-21SURC/S530-A3/TR8，Typ.61mcd@20mA, ROHS
J1#1 = JST_PH 2.00-5: 品牌：JST 型号：B5B-PH-K-S，直插，间距2.00，5pin; 名称: 插座2针，2.0间距; 制造商: JST; 物料编号: B5B-PH-K-S
R6-R8 R9#1 R10#1 R75 R76 = R-0603
RP4-RP6 = RP-0603
U1 = STM32F103CBU6: Mfr_Name: STMicroelectronics; RefDes: RefDes; Type: Type
U2 = CAT8xxxxxI-(G)T3: 3-Pin Microprocessor Power Supply Supervisors / − CAT803: Open−Drain Active LOW Reset / − CAT809: Push−Pull Active LOW Reset / − CAT810: Push−Pull Active HIGH Reset; Manufacturer: TI(德州仪器); Name: TLV70015DDCR; Add into BOM: yes; Output Type: 固定; Output Polarity: 正; Number of Outputs: 1; Maximum Input Voltage: 5.5V; Output Voltage: 1.5V; Dropout Voltage: 250mV@(200mA); Quiescent Current (Ground Current): 55uA; Output Current: 200mA; Power Supply Rejection Ratio (PSRR): 68dB@(1kHz); Symbol: TLV70015DDCR; Device: TLV70015DDCR; LCSC Part Name: TLV70015DDCR; Supplier Part: C2865100; Manufacturer Part: TLV70015DDCR; Supplier Footprint: SOT-23-Thin-5; JLCPCB Part Class: Extended Part; Datasheet: https://atta.szlcsc.com/upload/public/pdf/source/20230221/CBA3FAF2ECD8317094AE1D26AA0CA23B.pdf; Supplier: LCSC; Convert to PCB: yes; Operating Temperature: -40℃~+125℃@(Tj)
X1 = CRYSTAL: Crystal 8MHz ±10ppm 10pF 200 Ohm -10°C ~ 60°C Surface Mount 4-SMD, No Lead (DFN, LCC); Manufacturer: Abracon LLC; Manufacturer Part Number: ABM3B-8.000MHZ-10-1-U-T; Operating Mode: Fundamental; Supplier 1: Digi-Key; Supplier Part Number 1: 535-9721-1-ND; RoHS: RoHS Compliant; Category: Crystals, Oscillators, Resonators; Stock: 35437; Pricing 1: 1=0.69, 10=0.578, 50=0.5198, 100=0.462, 500=0.4389 (USD); Packaging: Cut Tape (CT); Part Status: Active; Type: MHz Crystal; Frequency Stability: ±10ppm; Frequency Tolerance: ±10ppm; Load Capacitance: 10pF; Operating Temperature: -10°C ~ 60°C; Ratings: -; Mounting Type: Surface Mount; Package / Case: 4-SMD, No Lead; Size / Dimension: 0.197" L x 0.126" W (5.00mm x 3.20mm); Height - Seated (Max): 0.043" (1.10mm); ComponentLink1URL: http://www.abracon.com/Resonators/abm3b.pdf; ComponentLink1Description: http://www.abracon.com/Resonators/abm3b.pdf; Supplier 2: Digi-Key; Supplier Part Number 2: 535-9721-2-ND; Pricing 2: 1000=0.336, 3000=0.315, 5000=0.3045, 10000=0.294 (USD)

## Sheet #NIP涡轮驱动板-DRIVE.SchDoc
size A3
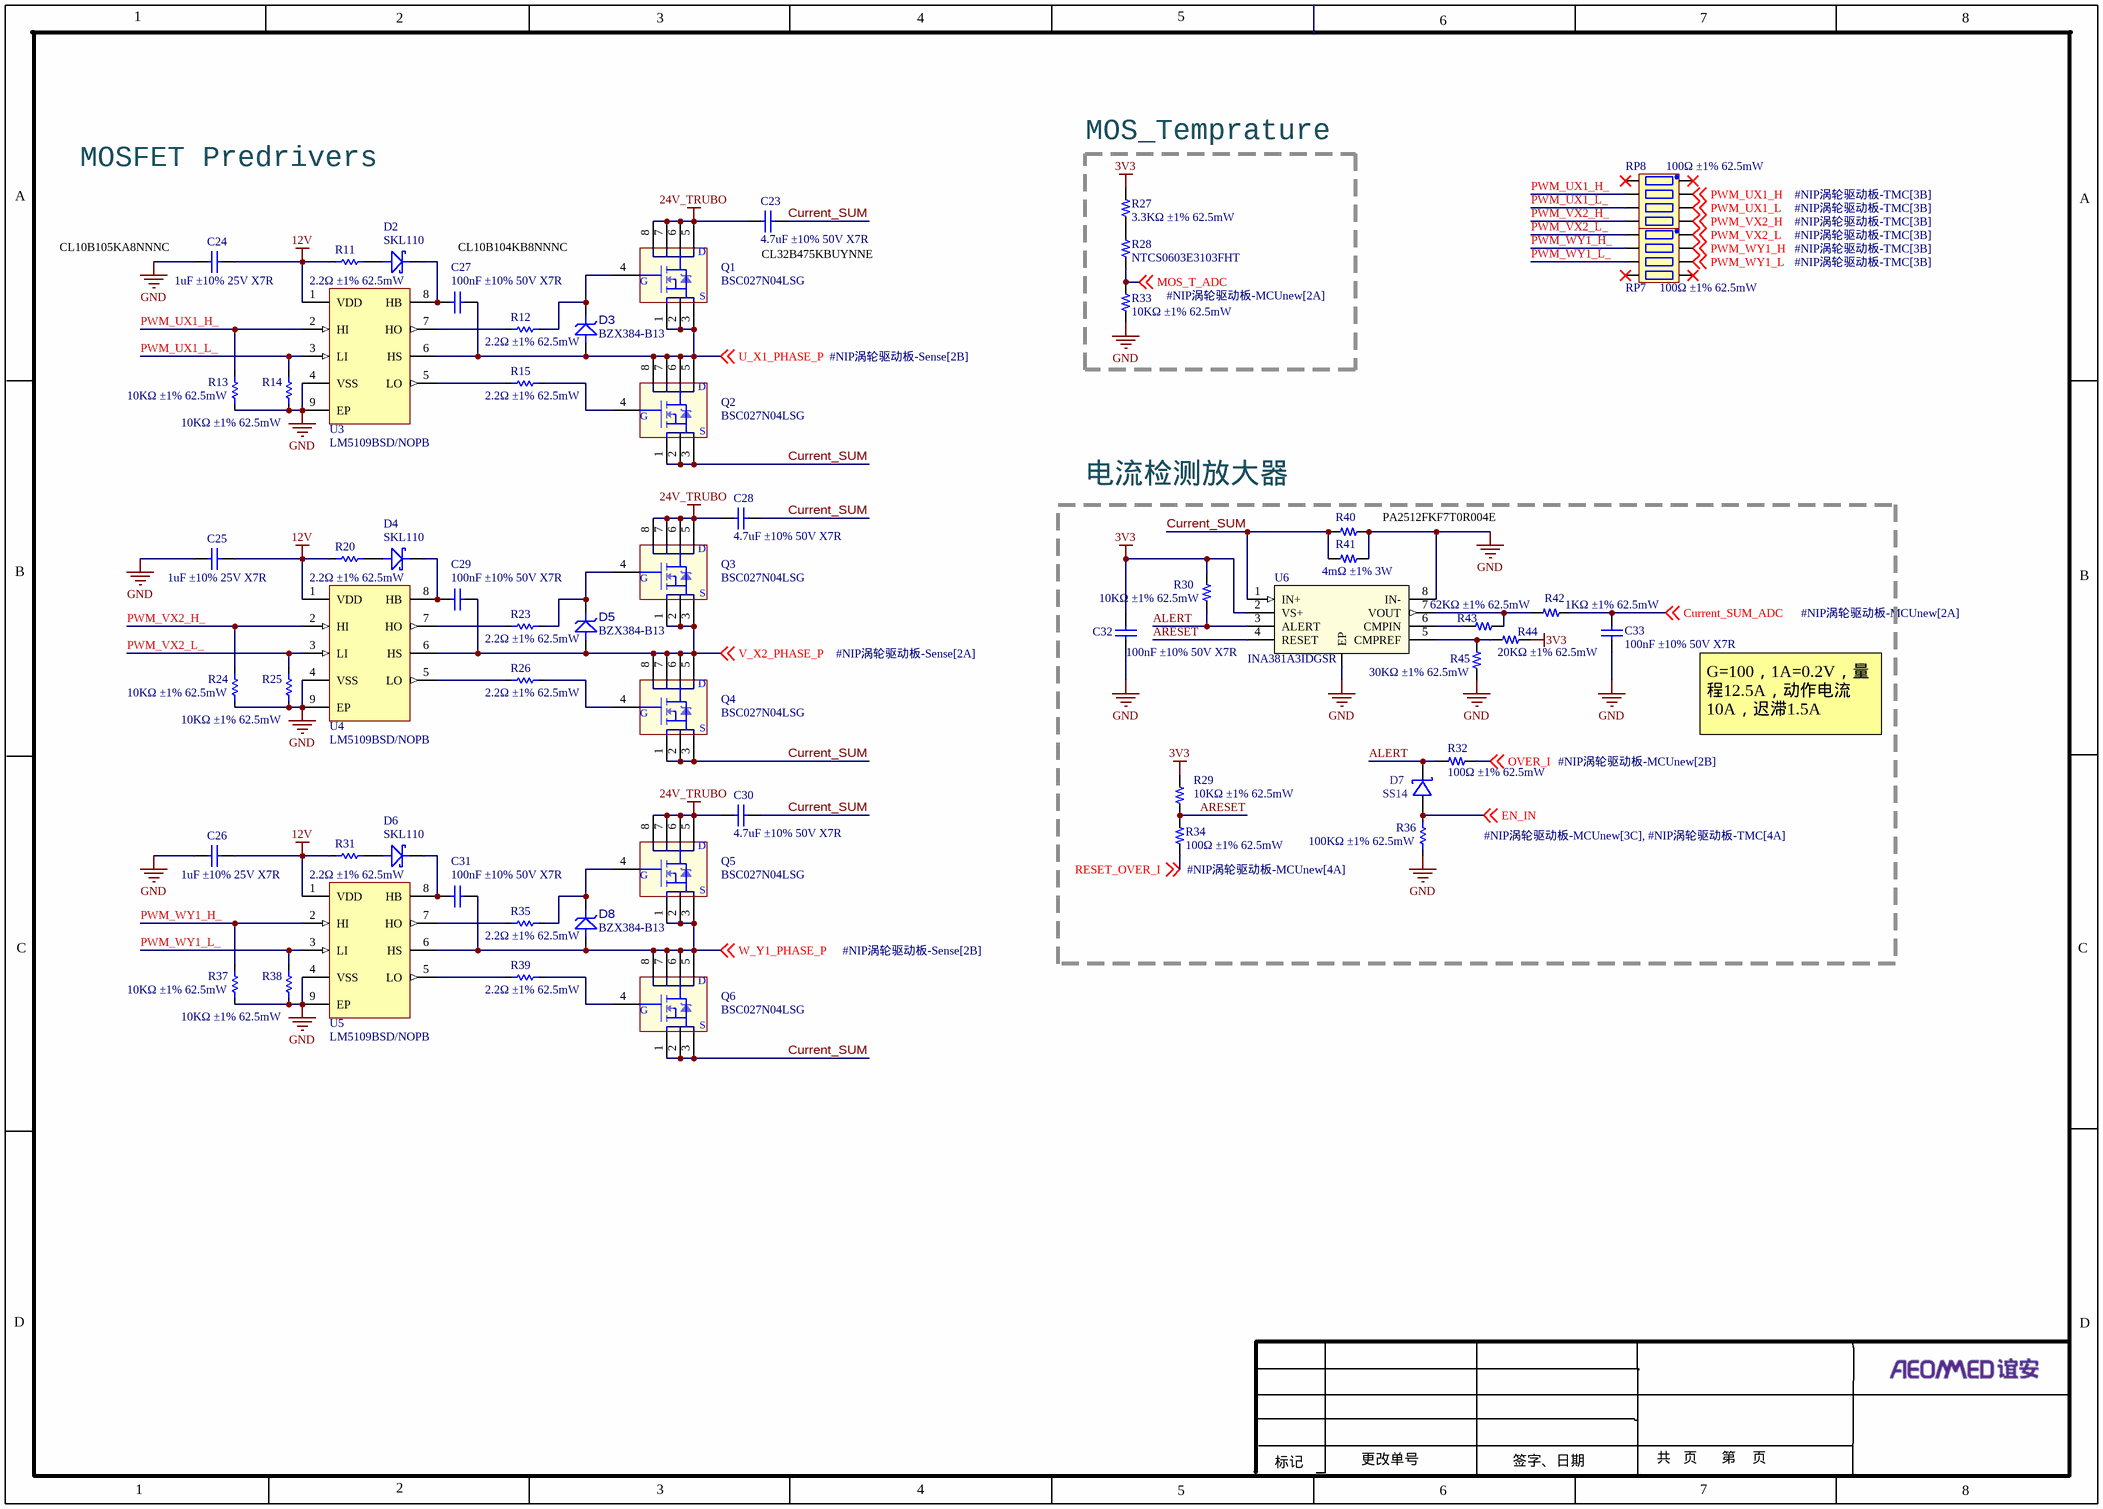
[diagram p3: #NIP涡轮驱动板-DRIVE.SchDoc]

### Parts
C23  4.7uF ±10% 50V X7R  [C-1210]
C24  1uF ±10% 25V X7R  [C0603]
C25  1uF ±10% 25V X7R  [C0603]
C26  1uF ±10% 25V X7R  [C0603]
C27  100nF ±10% 50V X7R  [C-0603]
C28  4.7uF ±10% 50V X7R  [C-1210]
C29  100nF ±10% 50V X7R  [C-0603]
C30  4.7uF ±10% 50V X7R  [C-1210]
C31  100nF ±10% 50V X7R  [C-0603]
C32  100nF ±10% 50V X7R  [C0402]
C33  100nF ±10% 50V X7R  [C0402]
D2  SKL110  [SODFL370X140-2N]
D3  BZX384-B13  [SOD2512X100N]
D4  SKL110  [SODFL370X140-2N]
D5  BZX384-B13  [SOD2512X100N]
D6  SKL110  [SODFL370X140-2N]
D7  SS14  [SOD-123_L2.7-W1.6-LS3.7-RD]
D8  BZX384-B13  [SOD2512X100N]
Q1  BSC027N04LSG  [PG-TDSON-8]
Q2  BSC027N04LSG  [PG-TDSON-8]
Q3  BSC027N04LSG  [PG-TDSON-8]
Q4  BSC027N04LSG  [PG-TDSON-8]
Q5  BSC027N04LSG  [PG-TDSON-8]
Q6  BSC027N04LSG  [PG-TDSON-8]
R11  2.2Ω ±1% 62.5mW  [R0402]
R12  2.2Ω ±1% 62.5mW  [R0402]
R13  10KΩ ±1% 62.5mW  [R0402]
R14  10KΩ ±1% 62.5mW  [R0402]
R15  2.2Ω ±1% 62.5mW  [R0402]
R20  2.2Ω ±1% 62.5mW  [R0402]
R23  2.2Ω ±1% 62.5mW  [R0402]
R24  10KΩ ±1% 62.5mW  [R0402]
R25  10KΩ ±1% 62.5mW  [R0402]
R26  2.2Ω ±1% 62.5mW  [R0402]
R27  3.3KΩ ±1% 62.5mW  [R0402]
R28  NTCS0603E3103FHT  [R-0603]
R29  10KΩ ±1% 62.5mW  [R0402]
R30  10KΩ ±1% 62.5mW  [R0402]
R31  2.2Ω ±1% 62.5mW  [R0402]
R32  100Ω ±1% 62.5mW  [R0402]
R33  10KΩ ±1% 62.5mW  [R0402]
R34  100Ω ±1% 62.5mW  [R0402]
R35  2.2Ω ±1% 62.5mW  [R0402]
R36  100KΩ ±1% 62.5mW  [R0402]
R37  10KΩ ±1% 62.5mW  [R0402]
R38  10KΩ ±1% 62.5mW  [R0402]
R39  2.2Ω ±1% 62.5mW  [R0402]
R40  4mΩ ±1% 3W  [R-2512_4PIN]  (value not drawn)
R41  4mΩ ±1% 3W  [R-2512_4PIN]
R42  1KΩ ±1% 62.5mW  [R0402]
R43  62KΩ ±1% 62.5mW  [R0402]
R44  20KΩ ±1% 62.5mW  [R0402]
R45  30KΩ ±1% 62.5mW  [R0402]
RP7  100Ω ±1% 62.5mW  [RES-ARRAY-SMD_0402-8P-L2.0-W1.0-BL]
RP8  100Ω ±1% 62.5mW  [RES-ARRAY-SMD_0402-8P-L2.0-W1.0-BL]
U3  LM5109BSD/NOPB  [PSON80P400X80_HS-9N]
U4  LM5109BSD/NOPB  [PSON80P400X80_HS-9N]
U5  LM5109BSD/NOPB  [PSON80P400X80_HS-9N]
U6  INA381A3IDGSR  [WSON-8_L2.0-W2.0-P0.50-BL-EP0.9]

### Blocks framed on the sheet
MOS_Temprature: R27 R28 R33
电流检测放大器: C32 C33 D7 R29 R30 R32 R34 R36 R40-R45 U6

### Nets
3V3: C32.1 R27.2 R29.1 R30.1 R44.2 U6.2(VS+)
12V: C24.1 C25.1 C26.1 R11.1 R20.1 R31.1 U3.1(VDD) U4.1(VDD) U5.1(VDD)
24V_TRUBO: C23.2 C28.2 C30.2 Q1.5(D) Q1.6(D) Q1.7(D) Q1.8(D) Q3.5(D) Q3.6(D) Q3.7(D) Q3.8(D) Q5.5(D) Q5.6(D) Q5.7(D) Q5.8(D)
GND: C24.2 C25.2 C26.2 C32.2 C33.1 R13.1 R14.1 R24.1 R25.1 R33.1 R36.2 R37.1 R38.1 R40.1 R41.1 R45.1 U3.4(VSS) U3.9(EP) U4.4(VSS) U4.9(EP) U5.4(VSS) U5.9(EP) U6.8(IN-) U6.9(EP)
ALERT: D7.1(K) R30.2 R32.1 U6.3(ALERT)
ARESET: R29.2 R34.1 U6.4(RESET)
Current_SUM: C23.1 C28.1 C30.1 Q2.1(S) Q2.2(S) Q2.3(S) Q4.1(S) Q4.2(S) Q4.3(S) Q6.1(S) Q6.2(S) Q6.3(S) R40.2 R41.2 U6.1(IN+)
Current_SUM_ADC: C33.2 R42.2 ; off-sheet Current_SUM_ADC
EN_IN: D7.2(A) R36.1 ; off-sheet EN_IN
MOS_T_ADC: R28.1 R33.2 ; off-sheet MOS_T_ADC
OVER_I: R32.2 ; off-sheet OVER_I
PWM_UX1_H: RP8.2 ; off-sheet PWM_UX1_H
PWM_UX1_H_: R13.2 RP8.7 U3.2(HI)
PWM_UX1_L: RP8.3 ; off-sheet PWM_UX1_L
PWM_UX1_L_: R14.2 RP8.6 U3.3(LI)
PWM_VX2_H: RP8.4 ; off-sheet PWM_VX2_H
PWM_VX2_H_: R24.2 RP8.5 U4.2(HI)
PWM_VX2_L: RP7.1 ; off-sheet PWM_VX2_L
PWM_VX2_L_: R25.2 RP7.8 U4.3(LI)
PWM_WY1_H: RP7.2 ; off-sheet PWM_WY1_H
PWM_WY1_H_: R37.2 RP7.7 U5.2(HI)
PWM_WY1_L: RP7.3 ; off-sheet PWM_WY1_L
PWM_WY1_L_: R38.2 RP7.6 U5.3(LI)
RESET_OVER_I: R34.2 ; off-sheet RESET_OVER_I
U_X1_PHASE_P: C27.1 D3.2(A) Q1.1(S) Q1.2(S) Q1.3(S) Q2.5(D) Q2.6(D) Q2.7(D) Q2.8(D) U3.6(HS) ; off-sheet U_X1_PHASE_P
V_X2_PHASE_P: C29.1 D5.2(A) Q3.1(S) Q3.2(S) Q3.3(S) Q4.5(D) Q4.6(D) Q4.7(D) Q4.8(D) U4.6(HS) ; off-sheet V_X2_PHASE_P
W_Y1_PHASE_P: C31.1 D8.2(A) Q5.1(S) Q5.2(S) Q5.3(S) Q6.5(D) Q6.6(D) Q6.7(D) Q6.8(D) U5.6(HS) ; off-sheet W_Y1_PHASE_P
NetC27_2: C27.2 D2.1 U3.8(HB)
NetC29_2: C29.2 D4.1 U4.8(HB)
NetC31_2: C31.2 D6.1 U5.8(HB)
NetD2_2: D2.2 R11.2
NetD3_1: D3.1(K) Q1.4(G) R12.2
NetD4_2: D4.2 R20.2
NetD5_1: D5.1(K) Q3.4(G) R23.2
NetD6_2: D6.2 R31.2
NetD8_1: D8.1(K) Q5.4(G) R35.2
NetQ2_4: Q2.4(G) R15.2
NetQ4_4: Q4.4(G) R26.2
NetQ6_4: Q6.4(G) R39.2
NetR12_1: R12.1 U3.7(HO)
NetR15_1: R15.1 U3.5(LO)
NetR23_1: R23.1 U4.7(HO)
NetR26_1: R26.1 U4.5(LO)
NetR27_1: R27.1 R28.2
NetR35_1: R35.1 U5.7(HO)
NetR39_1: R39.1 U5.5(LO)
NetR42_1: R42.1 R43.2 U6.7(VOUT)
NetR43_1: R43.1 U6.6(CMPIN)
NetR44_1: R44.1 R45.2 U6.5(CMPREF)

Not connected (* = marked no-connect by the designer): RP7 4* 5*; RP8 1* 8*

### Notes on the sheet
- MOSFET Predrivers
- (near C24) CL10B105KA8NNNC
- CL10B104KB8NNNC
- (near C23) CL32B475KBUYNNE
- PA2512FKF7T0R004E
- G=100，1A=0.2V，量程12.5A，动作电流10A，迟滞1.5A
- 1
- 2
- 3
- 4
- 5
- 6
- 7
- 8
- A
- B
- C
- D
- 更改单号
- 共   页      第    页
- 标记
- 签字、日期

### Library data of the parts
C23 C28 C30 = C-1210: CL32B475KBUYNNE
C24-C26 = Cap: CL10B105KA8NNNC; Published: 8-Jun-2000; LatestRevisionDate: 17-Jul-2002; LatestRevisionNote: Re-released for DXP Platform.; PackageReference: RAD-0.3; Publisher: Altium Limited; PackageDescription: Radial Cap, Thru-Hole; 2 Leads; 0.3 in Pin Spacing
C27 C29 C31 = C-0603: CL10B104KB8NNNC; 物料编号: *; 物料名称: *; 厂家: *; 详细描述: *
C32 C33 = Cap: Capacitor; Published: 8-Jun-2000; LatestRevisionDate: 17-Jul-2002; LatestRevisionNote: Re-released for DXP Platform.; PackageReference: RAD-0.3; Publisher: Altium Limited; PackageDescription: Radial Cap, Thru-Hole; 2 Leads; 0.3 in Pin Spacing
D2 D4 D6 = 50491: 品牌：DIOTEC，型号：SKL110，1A，100V，ROHS; Manufacturer: Diotec  Semiconductor; Id: 50491; Type: Diode; Value: 1A, 100V; Part Number: SKL110; HelpURL: http://diotec.com/tl_files/diotec/files/pdf/datasheets/skl12
D3 D5 D8 = ZENER: 品牌：NXP，型号：BZX384-B13，13V，SOD-323，ROHS; Manufacturer: Nexperia; Id: 50513; Type: ZEN; Value: 13V, 0.3W; Part Number: BZX384-B13; HelpURL: http://assets.nexperia.com/documents/data-sheet/BZX384_SERIES.pdf
D7 = Diode_Schottky: 直流反向耐压(Vr):40V;平均整流电流(Io):3A;正向压降(Vf):500mV@3A;; Manufacturer: DIODES(美台); Name: B340A-13-F; Add into BOM: yes; Reverse Voltage (Vr): 40V; Average Rectified Current (Io): 3A; Symbol: B340A-13-F; Device: B340A-13-F; LCSC Part Name: 40V 3A 500mV@3A; Supplier Part: C85098; Manufacturer Part: B340A-13-F; Supplier Footprint: SMA(DO-214AC); JLCPCB Part Class: 扩展库; Datasheet: https://atta.szlcsc.com/upload/public/pdf/source/20171023/C134454_15087453575121052549.pdf; Supplier: LCSC; Convert to PCB: yes; Forward Voltage (Vf@If): 500mV@3A
Q1-Q6 = BSC027N04LS: 品牌：INFINEON，型号： BSC027N04LSG，40V，100A，ROHS; 版本: V1.00; 名称: BSC030N08NS5ATMA1; 物料编号: apply; 详细描述: 品牌：INFINEON，型号： BSC027N04LSG，40V，100A，ROHS; 制造商: Infineon
R11 R20 R31 = Res_0402: Resistor; Published: 8-Jun-2000; LatestRevisionDate: 17-Jul-2002; LatestRevisionNote: Re-released for DXP Platform.; PackageReference: AXIAL-0.3; Publisher: Altium Limited; PackageDescription: Axial Device, Thru-Hole; 2 Leads; 0.3 in Pin Spacing
R12-R15 R23-R26 R35 R37-R39 = Res: Resistor; Published: 8-Jun-2000; LatestRevisionDate: 17-Jul-2002; LatestRevisionNote: Re-released for DXP Platform.; PackageReference: AXIAL-0.3; Publisher: Altium Limited; PackageDescription: Axial Device, Thru-Hole; 2 Leads; 0.3 in Pin Spacing
R27 R29 R30 R32-R34 R42-R45 = R-0603
R28 = R-0603: 品牌：VISHAY，型号：NTCS0603E3103FHT，10K@25℃, 1%，B=3960,ROHS
R36 = Res_0402: RC0402FR-07100KL; Published: 8-Jun-2000; LatestRevisionDate: 17-Jul-2002; LatestRevisionNote: Re-released for DXP Platform.; PackageReference: AXIAL-0.3; Publisher: Altium Limited; PackageDescription: Axial Device, Thru-Hole; 2 Leads; 0.3 in Pin Spacing
R40 R41 = R-2512: PA2512FKF7T0R004E
RP7 RP8 = RP-0603
U3-U5 = LM5109: 品牌：TI，型号：LM5109BSD/NOPB，ROHS; Manufacturer: Texas Instruments; Id: 50490; Value: 108V 1A; Part Number: LM5109BSD/NOPB; Type: DRV; HelpURL: http://www.ti.com/lit/ds/symlink/lm5109b.pdf
U6 = INA381A2IDSGR: 品牌：TI，型号：INA381A1IDGSR，ROHS; Mfr_Name: Texas Instruments; Copyright: Copyright (C) 2022 Ultra Librarian. All rights reserved.; Manufacturer_Part_Number: INA381A3IDGSR; RefDes: RefDes; Type: DEV

## Sheet #NIP涡轮驱动板-Sense.SchDoc
size A3
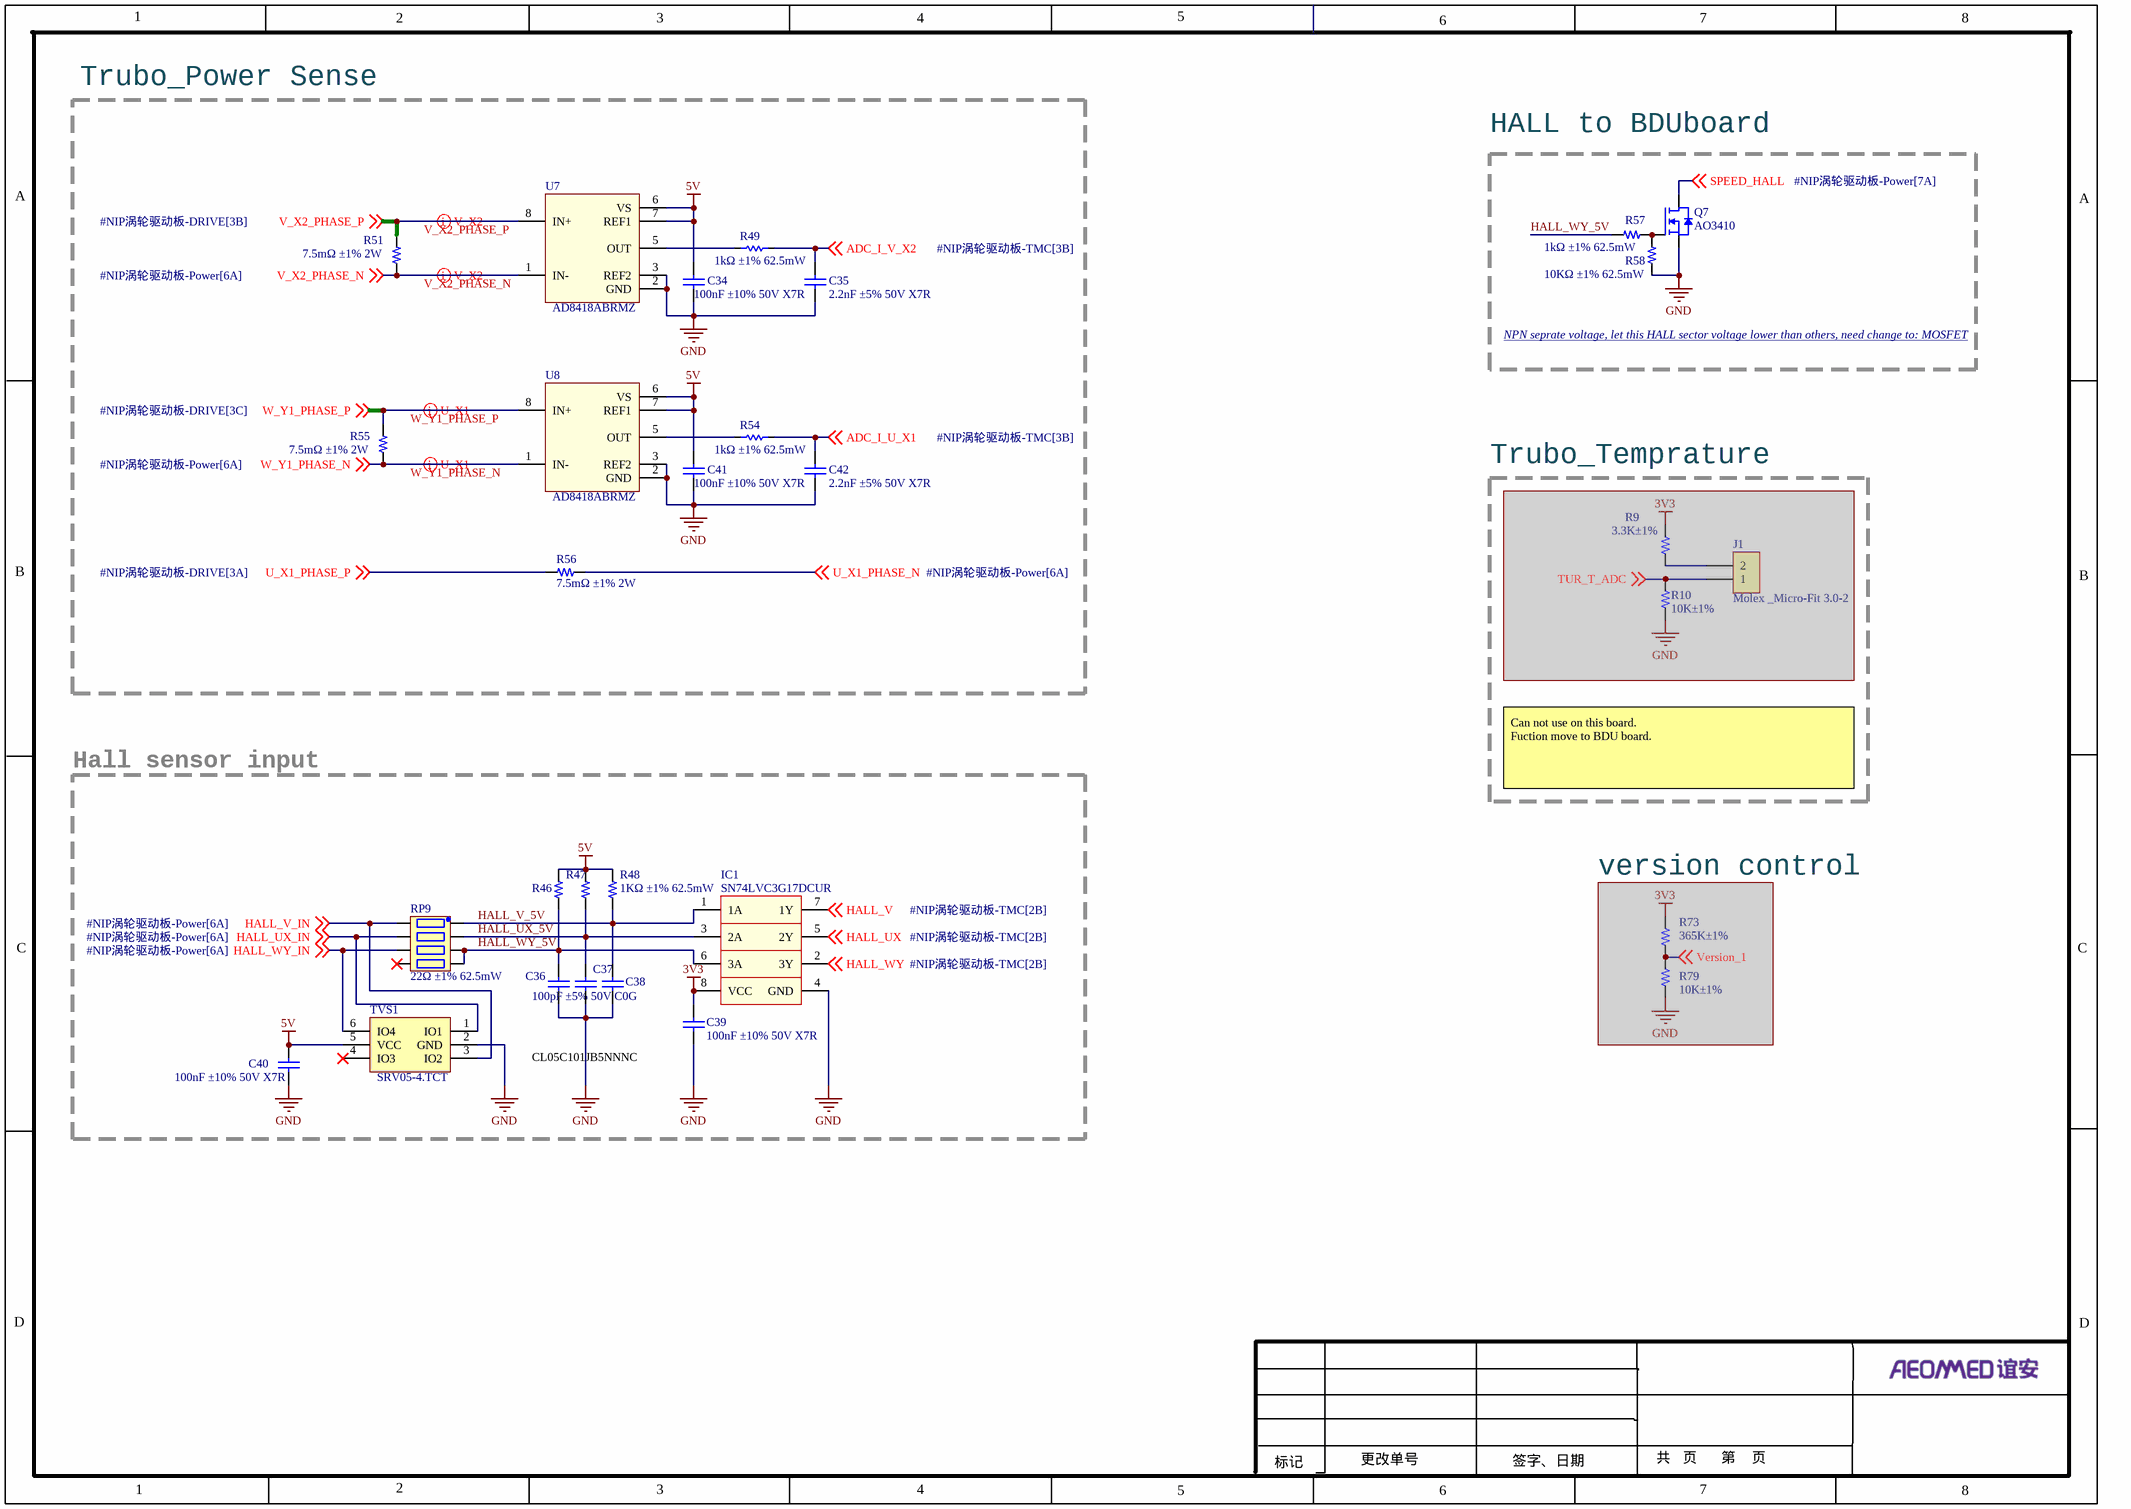
[diagram p4: #NIP涡轮驱动板-Sense.SchDoc]

### Parts
(Parts that share a designator on the sheet are numbered #1, #2 ... from top to bottom, then left to right.)
C34  100nF ±10% 50V X7R  [C0402]
C35  2.2nF ±5% 50V X7R  [C0402]
C36  100pF ±5% 50V C0G  [C0402]
C37  100pF ±5% 50V C0G  [C0402]  (value not drawn)
C38  100pF ±5% 50V C0G  [C0402]  (value not drawn)
C39  100nF ±10% 50V X7R  [C0402]
C40  100nF ±10% 50V X7R  [C0402]
C41  100nF ±10% 50V X7R  [C0402]
C42  2.2nF ±5% 50V X7R  [C0402]
IC1  SN74LVC3G17DCUR  [TSSOP50P310X90-8L]
J1#2  Molex _Micro-Fit 3.0-2  [Molex _Micro-Fit 3.0 2X1]  (masked out: inside a compile mask, not in the netlist)
Q7  AO3410  [SOT23-3]
R9#2  3.3K±1%  [R-0603]  (masked out: inside a compile mask, not in the netlist)
R10#2  10K±1%  [R-0603]  (masked out: inside a compile mask, not in the netlist)
R46  1KΩ ±1% 62.5mW  [R0402]  (value not drawn)
R47  1KΩ ±1% 62.5mW  [R0402]  (value not drawn)
R48  1KΩ ±1% 62.5mW  [R0402]
R49  1kΩ ±1% 62.5mW  [R0402]
R51  7.5mΩ ±1% 2W  [R-2512_4PIN]
R54  1kΩ ±1% 62.5mW  [R0402]
R55  7.5mΩ ±1% 2W  [R-2512_4PIN]
R56  7.5mΩ ±1% 2W  [R-2512_4PIN]
R57  1kΩ ±1% 62.5mW  [R0402]
R58  10KΩ ±1% 62.5mW  [R0402]
R73#2  365K±1%  [R-0603]  (masked out: inside a compile mask, not in the netlist)
R79  10K±1%  [R-0603]  (masked out: inside a compile mask, not in the netlist)
RP9  22Ω ±1% 62.5mW  [RES-ARRAY-SMD_0402-8P-L2.0-W1.0-BL]
TVS1  SRV05-4.TCT  [SOT95P280X145-6N]
U7  AD8418ABRMZ  [TSOP65P490X95-8N]
U8  AD8418ABRMZ  [TSOP65P490X95-8N]

### Blocks framed on the sheet
Trubo_Power Sense: C34 C35 C41 C42 R49 R51 R54-R56 U7 U8
HALL to BDUboard: Q7 R57 R58
Trubo_Temprature: J1#2 R9#2 R10#2
Hall sensor input: C36-C40 IC1 R46-R48 RP9 TVS1

### Nets
3V3: C39.2 IC1.8(VCC)
5V: C34.1 C40.1 C41.1 R46.2 R47.2 R48.2 TVS1.5(VCC) U7.6(VS) U7.7(REF1) U8.6(VS) U8.7(REF1)
GND: C34.2 C35.2 C36.1 C37.1 C38.1 C39.1 C40.2 C41.2 C42.2 IC1.4(GND) Q7.2(S) R58.2 TVS1.2(GND) U7.2(GND) U7.3(REF2) U8.2(GND) U8.3(REF2)
ADC_I_U_X1: C42.1 R54.2 ; off-sheet ADC_I_U_X1
ADC_I_V_X2: C35.1 R49.2 ; off-sheet ADC_I_V_X2
HALL_UX: IC1.5(2Y) ; off-sheet HALL_UX
HALL_UX_5V: C37.2 IC1.3(2A) R47.1 RP9.2
HALL_UX_IN: RP9.7 TVS1.1(IO1) ; off-sheet HALL_UX_IN
HALL_V: IC1.7(1Y) ; off-sheet HALL_V
HALL_V_5V: C38.2 IC1.1(1A) R48.1 RP9.1
HALL_V_IN: RP9.8 TVS1.3(IO2) ; off-sheet HALL_V_IN
HALL_WY: IC1.2(3Y) ; off-sheet HALL_WY
HALL_WY_5V: C36.2 IC1.6(3A) R46.1 R57.2 RP9.3 RP9.4
HALL_WY_IN: RP9.6 TVS1.6(IO4) ; off-sheet HALL_WY_IN
SPEED_HALL: Q7.3(D) ; off-sheet SPEED_HALL
U_X1_PHASE_N: R56.1 ; off-sheet U_X1_PHASE_N
U_X1_PHASE_P: R56.2 ; off-sheet U_X1_PHASE_P
V_X2_PHASE_N: R51.1 U7.1(IN-) ; off-sheet V_X2_PHASE_N
V_X2_PHASE_P: R51.2 U7.8(IN+) ; off-sheet V_X2_PHASE_P
W_Y1_PHASE_N: R55.1 U8.1(IN-) ; off-sheet W_Y1_PHASE_N
W_Y1_PHASE_P: R55.2 U8.8(IN+) ; off-sheet W_Y1_PHASE_P
NetQ7_1: Q7.1(G) R57.1 R58.1
NetR49_1: R49.1 U7.5(OUT)
NetR54_1: R54.1 U8.5(OUT)

Not connected (* = marked no-connect by the designer): RP9 5*; TVS1 4(IO3)*

### Layout directives
differential pair: V_X2_PHASE_N, V_X2_PHASE_P, W_Y1_PHASE_N, W_Y1_PHASE_P

### Notes on the sheet
- NPN seprate voltage, let this HALL sector voltage lower than others, need change to: MOSFET
- Can not use on this board.
  Fuction move to BDU board.
- (near R73#2) version control
- CL05C101JB5NNNC
- 1
- 2
- 3
- 4
- 5
- 6
- 7
- 8
- A
- B
- C
- D
- 更改单号
- 共   页      第    页
- 标记
- 签字、日期

### Library data of the parts
C34 C39-C41 = Cap: Capacitor; Published: 8-Jun-2000; LatestRevisionDate: 17-Jul-2002; LatestRevisionNote: Re-released for DXP Platform.; PackageReference: RAD-0.3; Publisher: Altium Limited; PackageDescription: Radial Cap, Thru-Hole; 2 Leads; 0.3 in Pin Spacing
C35 C42 = Cap: CL05B222JB5NNNC; Published: 8-Jun-2000; LatestRevisionDate: 17-Jul-2002; LatestRevisionNote: Re-released for DXP Platform.; PackageReference: RAD-0.3; Publisher: Altium Limited; PackageDescription: Radial Cap, Thru-Hole; 2 Leads; 0.3 in Pin Spacing
C36-C38 = Cap: CL05C101JB5NNNC; Published: 8-Jun-2000; LatestRevisionDate: 17-Jul-2002; LatestRevisionNote: Re-released for DXP Platform.; PackageReference: RAD-0.3; Publisher: Altium Limited; PackageDescription: Radial Cap, Thru-Hole; 2 Leads; 0.3 in Pin Spacing
IC1 = SN74LVC3G17DCUR: 品牌：TI，型号： 74LVC3G17, 1.65 V to 5.5 V, VSSOP-8，，ROH; MF: TEXAS INSTRUMENTS; MPN: SN74LVC3G17DCUR
J1#2 = Molex _Micro-Fit 3.0-2: 品牌：Molex,型号：43045-0227，直插，间距3.00，2pin，表面镀锡，ROHS; 名称: 接插件; 物料编号: 43045-0227; 详细描述: 品牌：Molex,型号：43045-0227，直插，间距3.00，2pin，表面镀锡，ROHS; 制造商: Molex
R9#2 R10#2 R46-R48 R57 R58 R73#2 R79 = R-0603
R49 R54 = Res_0402: Resistor; Published: 8-Jun-2000; LatestRevisionDate: 17-Jul-2002; LatestRevisionNote: Re-released for DXP Platform.; PackageReference: AXIAL-0.3; Publisher: Altium Limited; PackageDescription: Axial Device, Thru-Hole; 2 Leads; 0.3 in Pin Spacing
R51 R55 R56 = R-2512: PA2512FKF7W7U5E / 7.5mOhms 2W 100PPM/C 1 % 2512
RP9 = RP-0603
TVS1 = ESD, TVS, SRV05-4.TCT: 品牌：SEMTECH ，型号：SRV05-4.TCT，ROHS; MPN: SRV05-4.TCT; MF: SEMTECH
U7 U8 = AD8418: 品牌：ADI，型号：AD8418ABRMZ，ROHS; Manufacturer: Analog Devices; Id: 50496; Value: CMVR=70V; Part Number: AD8418ABRMZ; Type: DIFAMP; HelpURL: http://www.analog.com/media/en/technical-documentation/data-sheets/AD8418A.pdf

## Nets that join several sheets
3V3: #NIP涡轮驱动板-Power (5 pins), #NIP涡轮驱动板-TMC (21 pins), #NIP涡轮驱动板-MCUnew (16 pins), #NIP涡轮驱动板-DRIVE (6 pins), #NIP涡轮驱动板-Sense (C39.2 IC1.8)
5V: #NIP涡轮驱动板-Power (13 pins), #NIP涡轮驱动板-TMC (5 pins), #NIP涡轮驱动板-Sense (11 pins)
12V: #NIP涡轮驱动板-Power (6 pins), #NIP涡轮驱动板-DRIVE (9 pins)
24V_TRUBO: #NIP涡轮驱动板-Power (Q8.S R62.2 U9.7 U9.8), #NIP涡轮驱动板-TMC (R1.2), #NIP涡轮驱动板-DRIVE (15 pins)
GND: #NIP涡轮驱动板-Power (40 pins), #NIP涡轮驱动板-TMC (35 pins), #NIP涡轮驱动板-MCUnew (18 pins), #NIP涡轮驱动板-DRIVE (24 pins), #NIP涡轮驱动板-Sense (17 pins)
AD_SPEED: #NIP涡轮驱动板-Power (C59.2 R72.1), #NIP涡轮驱动板-MCUnew (U1.11)
ADC_I_U_X1: #NIP涡轮驱动板-TMC (IC200.16), #NIP涡轮驱动板-Sense (C42.1 R54.2)
ADC_I_V_X2: #NIP涡轮驱动板-TMC (IC200.18), #NIP涡轮驱动板-Sense (C35.1 R49.2)
BRAKE_EN: #NIP涡轮驱动板-Power (R65.1), #NIP涡轮驱动板-MCUnew (U1.40)
Current_SUM_ADC: #NIP涡轮驱动板-MCUnew (U1.13), #NIP涡轮驱动板-DRIVE (C33.2 R42.2)
D_EN: #NIP涡轮驱动板-Power (R63.1), #NIP涡轮驱动板-TMC (R3.2), #NIP涡轮驱动板-MCUnew (U1.45)
EN_IN: #NIP涡轮驱动板-TMC (IC200.55), #NIP涡轮驱动板-MCUnew (RP4.5), #NIP涡轮驱动板-DRIVE (D7.2 R36.1)
EN_OUT: #NIP涡轮驱动板-TMC (IC200.32 R3.1), #NIP涡轮驱动板-MCUnew (RP5.8)
HALL_UX: #NIP涡轮驱动板-TMC (IC200.38), #NIP涡轮驱动板-Sense (IC1.5)
HALL_UX_IN: #NIP涡轮驱动板-Power (U9.17), #NIP涡轮驱动板-Sense (RP9.7 TVS1.1)
HALL_V: #NIP涡轮驱动板-TMC (IC200.37), #NIP涡轮驱动板-Sense (IC1.7)
HALL_V_IN: #NIP涡轮驱动板-Power (U9.18), #NIP涡轮驱动板-Sense (RP9.8 TVS1.3)
HALL_WY: #NIP涡轮驱动板-TMC (IC200.36), #NIP涡轮驱动板-Sense (IC1.2)
HALL_WY_IN: #NIP涡轮驱动板-Power (U9.20), #NIP涡轮驱动板-Sense (RP9.6 TVS1.6)
I_SET: #NIP涡轮驱动板-Power (U9.31), #NIP涡轮驱动板-MCUnew (U1.18)
MOS_T_ADC: #NIP涡轮驱动板-MCUnew (U1.12), #NIP涡轮驱动板-DRIVE (R28.1 R33.2)
OVER_I: #NIP涡轮驱动板-MCUnew (U1.39), #NIP涡轮驱动板-DRIVE (R32.2)
PWM_IN: #NIP涡轮驱动板-TMC (IC200.58), #NIP涡轮驱动板-MCUnew (RP4.8)
PWM_UX1_H: #NIP涡轮驱动板-TMC (IC200.39), #NIP涡轮驱动板-DRIVE (RP8.2)
PWM_UX1_L: #NIP涡轮驱动板-TMC (IC200.40), #NIP涡轮驱动板-DRIVE (RP8.3)
PWM_VX2_H: #NIP涡轮驱动板-TMC (IC200.41), #NIP涡轮驱动板-DRIVE (RP8.4)
PWM_VX2_L: #NIP涡轮驱动板-TMC (IC200.42), #NIP涡轮驱动板-DRIVE (RP7.1)
PWM_WY1_H: #NIP涡轮驱动板-TMC (IC200.46), #NIP涡轮驱动板-DRIVE (RP7.2)
PWM_WY1_L: #NIP涡轮驱动板-TMC (IC200.47), #NIP涡轮驱动板-DRIVE (RP7.3)
READY: #NIP涡轮驱动板-Power (U9.26), #NIP涡轮驱动板-MCUnew (U1.43)
RESET_OVER_I: #NIP涡轮驱动板-MCUnew (U1.2), #NIP涡轮驱动板-DRIVE (R34.2)
SD_DIR: #NIP涡轮驱动板-TMC (IC200.56), #NIP涡轮驱动板-MCUnew (RP4.6)
SD_STP: #NIP涡轮驱动板-TMC (IC200.57), #NIP涡轮驱动板-MCUnew (RP4.7)
SPEED_HALL: #NIP涡轮驱动板-Power (U9.29), #NIP涡轮驱动板-Sense (Q7.3)
SPI_MISO: #NIP涡轮驱动板-TMC (IC200.9), #NIP涡轮驱动板-MCUnew (RP6.8)
SPI_MOSI: #NIP涡轮驱动板-TMC (IC200.8), #NIP涡轮驱动板-MCUnew (RP6.7)
SPI_nSCS: #NIP涡轮驱动板-TMC (IC200.6), #NIP涡轮驱动板-MCUnew (RP6.5)
SPI_SCK: #NIP涡轮驱动板-TMC (IC200.7), #NIP涡轮驱动板-MCUnew (RP6.6)
STATUS: #NIP涡轮驱动板-TMC (IC200.12), #NIP涡轮驱动板-MCUnew (RP5.7)
U_X1_PHASE_N: #NIP涡轮驱动板-Power (U9.1 U9.2), #NIP涡轮驱动板-Sense (R56.1)
U_X1_PHASE_P: #NIP涡轮驱动板-DRIVE (10 pins), #NIP涡轮驱动板-Sense (R56.2)
USART_RXD: #NIP涡轮驱动板-TMC (IC200.10), #NIP涡轮驱动板-MCUnew (RP5.5)
USART_TXD: #NIP涡轮驱动板-TMC (IC200.11), #NIP涡轮驱动板-MCUnew (RP5.6)
V_X2_PHASE_N: #NIP涡轮驱动板-Power (U9.3 U9.4), #NIP涡轮驱动板-Sense (R51.1 U7.1)
V_X2_PHASE_P: #NIP涡轮驱动板-DRIVE (10 pins), #NIP涡轮驱动板-Sense (R51.2 U7.8)
VM_ADC: #NIP涡轮驱动板-TMC (C43.2 R16.2), #NIP涡轮驱动板-MCUnew (U1.10)
W_Y1_PHASE_N: #NIP涡轮驱动板-Power (U9.5 U9.6), #NIP涡轮驱动板-Sense (R55.1 U8.1)
W_Y1_PHASE_P: #NIP涡轮驱动板-DRIVE (10 pins), #NIP涡轮驱动板-Sense (R55.2 U8.8)